# Altium project ClubNIKA.PrjPcb
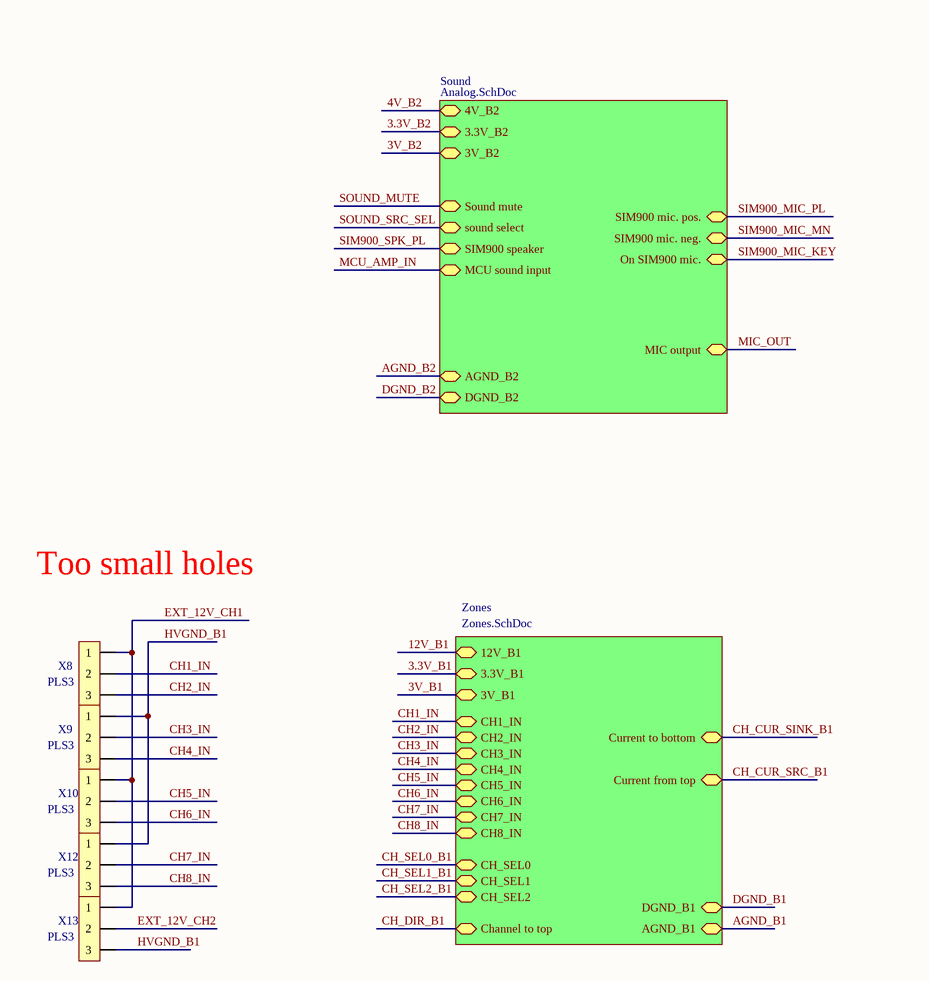
[diagram p0: ClubNIKA.SchDoc, top left]
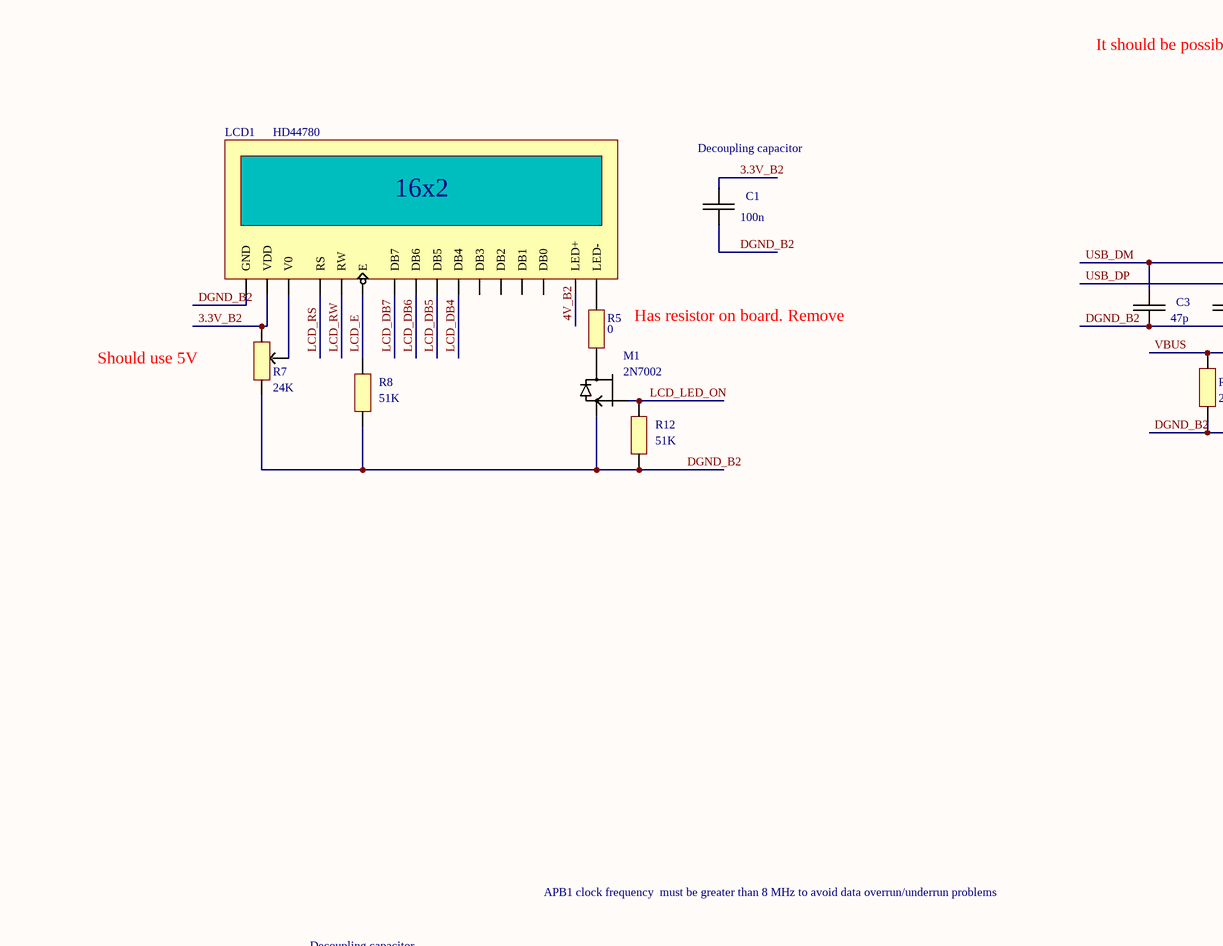
[diagram p1: ClubNIKA.SchDoc, top middle]
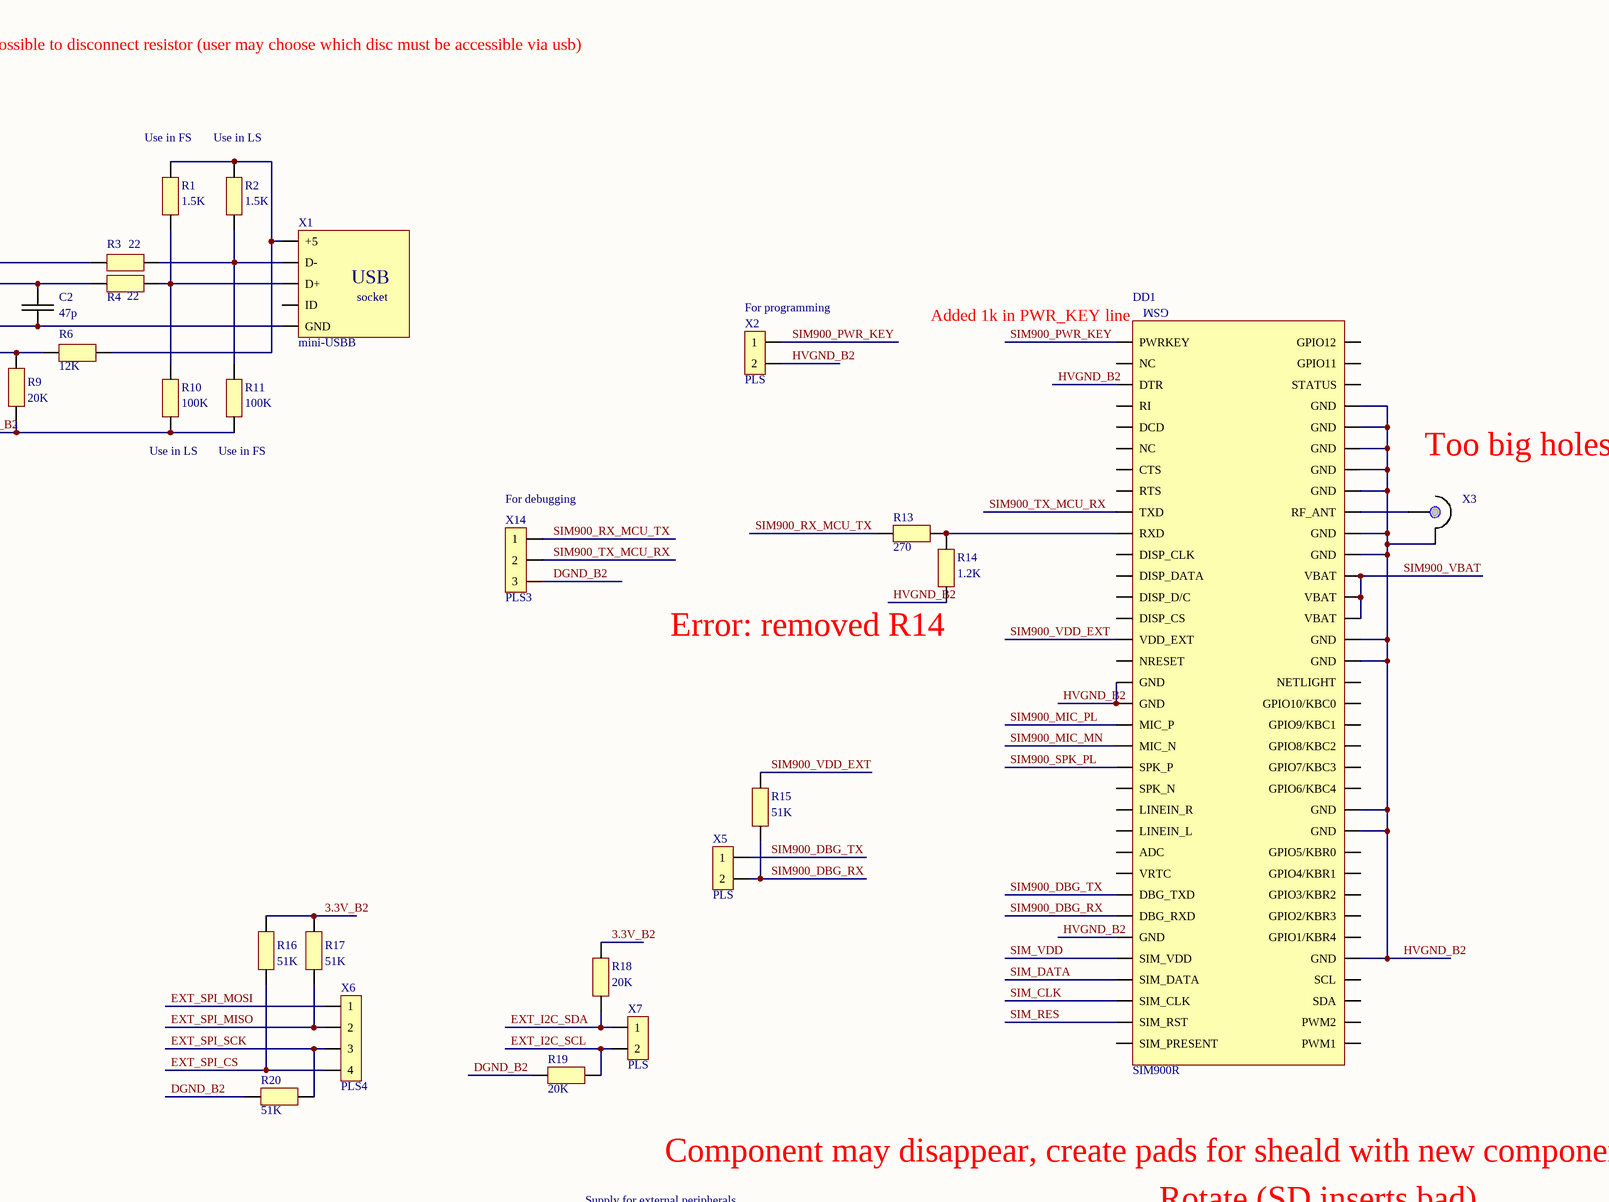
[diagram p2: ClubNIKA.SchDoc, top right]
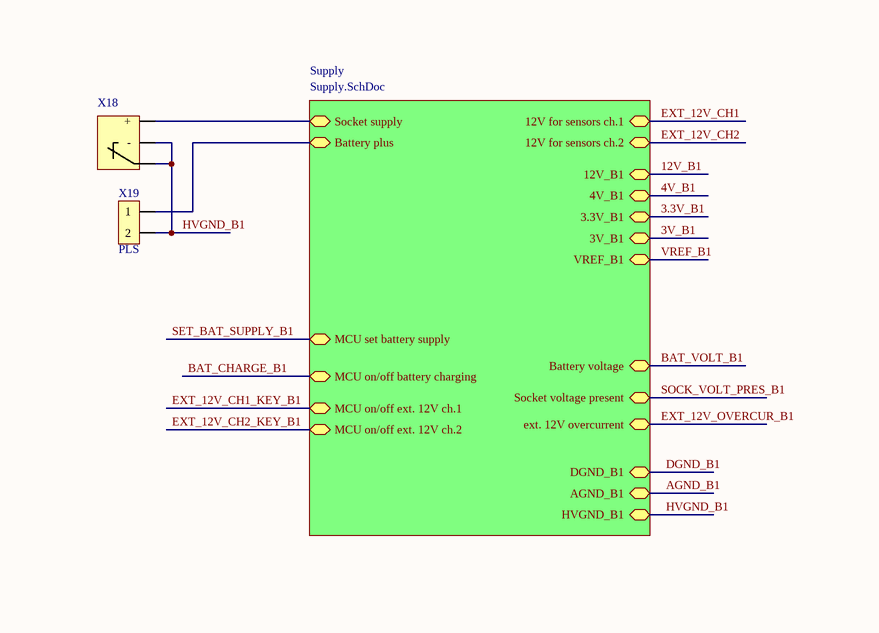
[diagram p3: ClubNIKA.SchDoc, bottom left]
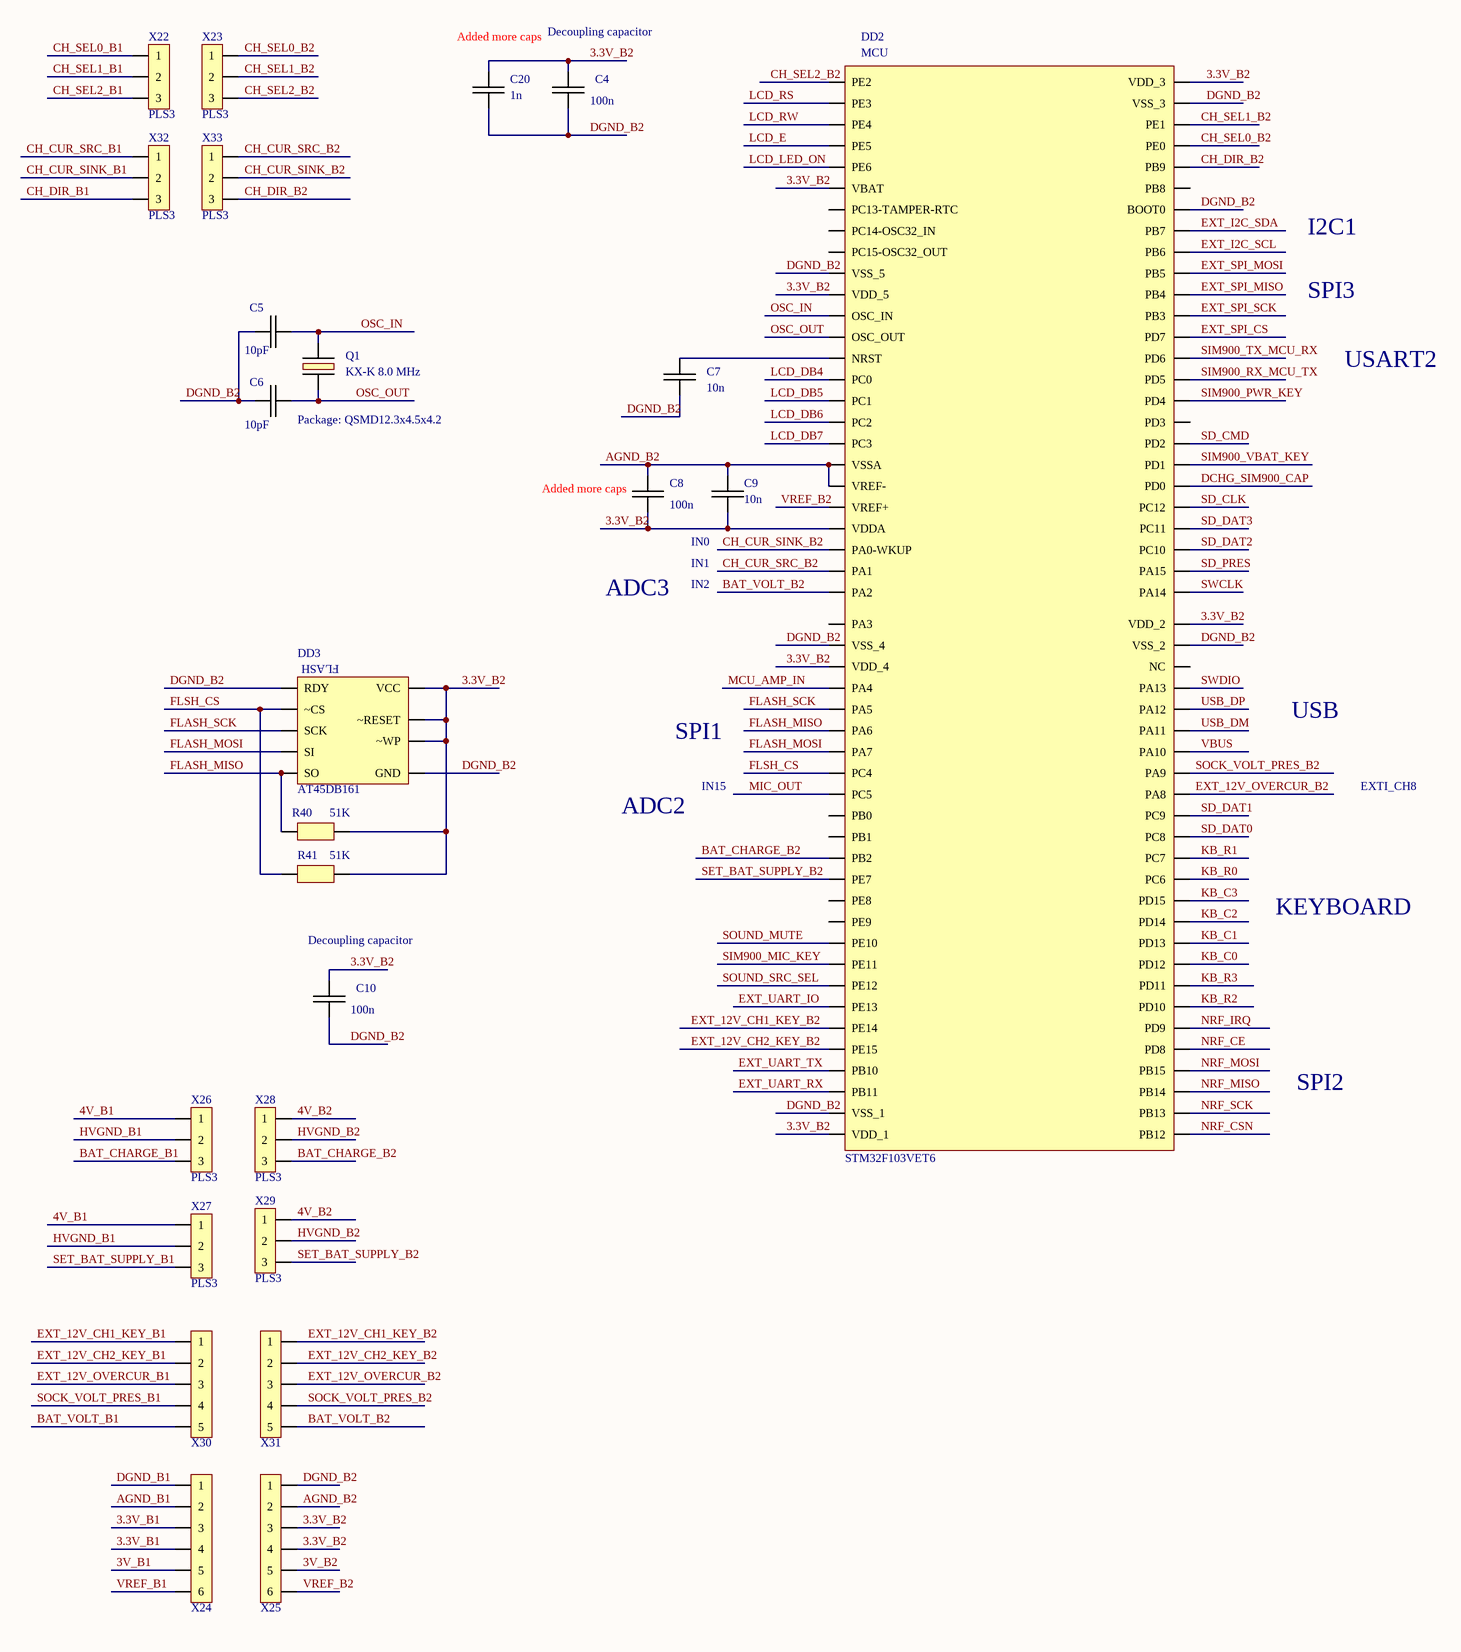
[diagram p4: ClubNIKA.SchDoc, bottom middle]
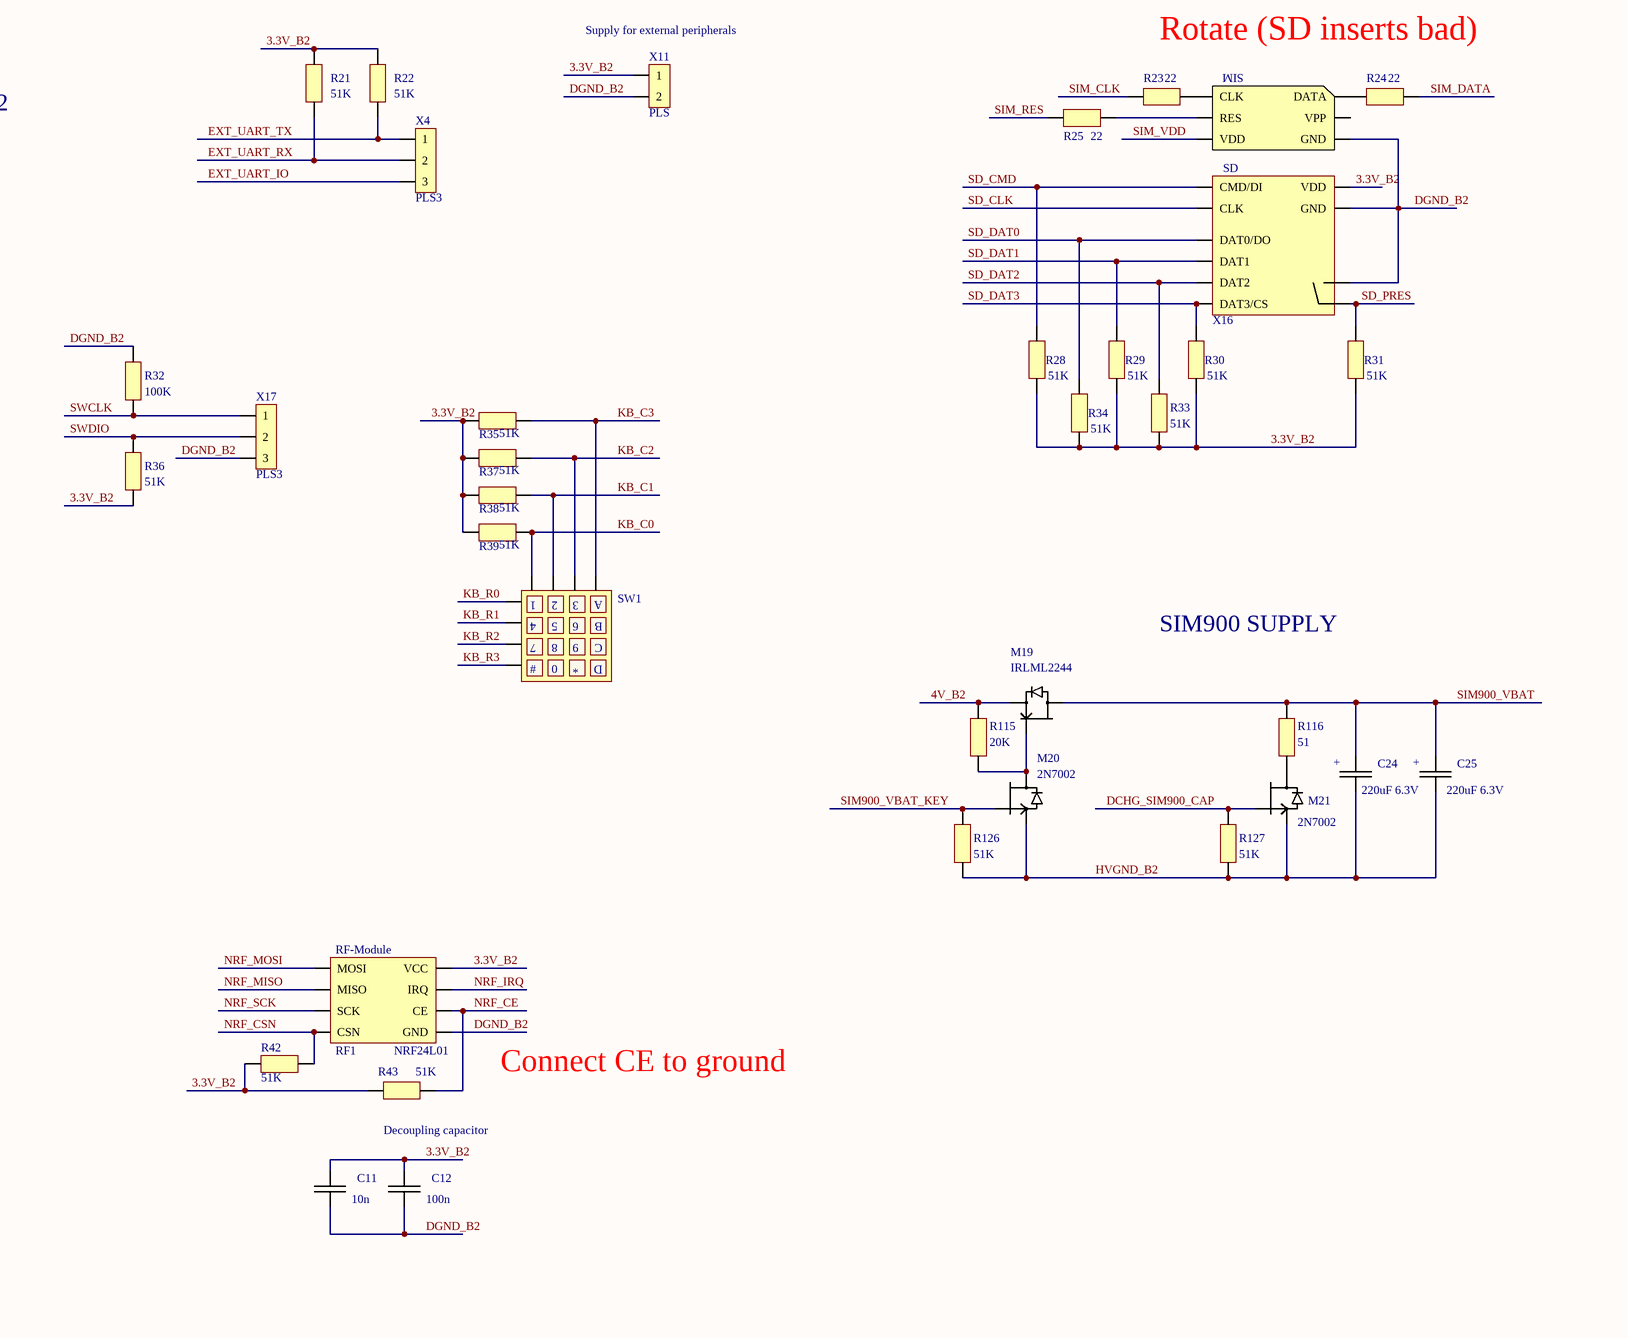
[diagram p5: ClubNIKA.SchDoc, bottom right]
4 sheets, 346 parts. Net scope: hierarchical (ports join the sheet entries above them; power ports are global).
Board file: ClubNIKA.PcbDoc
Sheets:
  ClubNIKA.SchDoc
    Zones = Zones.SchDoc
    Supply = Supply.SchDoc
    Sound = Analog.SchDoc

## Sheet ClubNIKA.SchDoc
size A1

### Parts
C1  100n  [0805]
C2  47p  [0805]
C3  47p  [0805]
C4  100n  [0805]
C5  10pF  [0805]
C6  10pF  [0805]
C7  10n  [0805]
C8  100n  [0805]
C9  10n  [0805]
C10  100n  [0805]
C11  10n  [0805]
C12  100n  [0805]
C20  1n  [0805]
C24  220uF 6.3V  [CALUM_THT_E5D13]
C25  220uF 6.3V  [CALUM_THT_E5D13]
DD1  SIM900R  [SIM900_R]
DD2  STM32F103VET6  [QFP100]
DD3  AT45DB161  [TSOP28]
LCD1  HD44780  [LCD_HD44780_5]
M1  2N7002  [SOT-23]
M19  IRLML2244  [SOT-23]
M20  2N7002  [SOT-23]
M21  2N7002  [SOT-23]
Q1  KX-K 8.0 MHz  [OSC1_THT_10,8x4,5]
R1  1.5K  [0805]
R2  1.5K  [0805]
R3  22  [0805]
R4  22  [0805]
R5  0  [1206]
R6  12K  [0805]
R7  24K  [3305SMD(adj res)]
R8  51K  [0805]
R9  20K  [0805]
R10  100K  [0805]
R11  100K  [0805]
R12  51K  [0805]
R13  270  [0805]
R14  1.2K  [0805]
R15  51K  [0805]
R16  51K  [0805]
R17  51K  [0805]
R18  20K  [0805]
R19  20K  [0805]
R20  51K  [0805]
R21  51K  [0805]
R22  51K  [0805]
R23  22  [0805]
R24  22  [0805]
R25  22  [0805]
R28  51K  [0805]
R29  51K  [0805]
R30  51K  [0805]
R31  51K  [0805]
R32  100K  [0805]
R33  51K  [0805]
R34  51K  [0805]
R35  51K  [0805]
R36  51K  [0805]
R37  51K  [0805]
R38  51K  [0805]
R39  51K  [0805]
R40  51K  [0805]
R41  51K  [0805]
R42  51K  [0805]
R43  51K  [0805]
R115  20K  [0805]
R116  51  [0805]
R126  51K  [0805]
R127  51K  [0805]
RF1  NRF24L01  [NRF24L01_MOD_ANGLE]
SW1  KEYBOARD4x4  [KEYBOURD_4x4_1]  (value not drawn)
X1  mini-USBB  [MINI_USBA_FEMALE]
X2  PLS  [PLS_2]
X3  SMA_FEMALE  [SMA_FEMALE]  (value not drawn)
X4  PLS3  [PLS_3]
X5  PLS  [PLS_2]
X6  PLS4  [PLS_4]
X7  PLS  [PLS_2]
X8  PLS3  [TERMINALS_7.7x15.5(step 5mm)]
X9  PLS3  [TERMINALS_7.7x15.5(step 5mm)]
X10  PLS3  [TERMINALS_7.7x15.5(step 5mm)]
X11  PLS  [PLS_2]
X12  PLS3  [TERMINALS_7.7x15.5(step 5mm)]
X13  PLS3  [TERMINALS_7.7x15.5(step 5mm)]
X14  PLS3  [PLS_3]
X16  SIM_SD_HOLDER1  [SIM_SD_HOLDER1]  (value not drawn)
X17  PLS3  [PLS_3]
X18  SUPPLY_1  [SUP_SOCK_D5.5D1.8]  (value not drawn)
X19  PLS  [PLS_2]
X22  PLS3  [PLS_3]
X23  PLS3  [PLS_3]
X24  PLS6  [PLS_6]  (value not drawn)
X25  PLS6  [PLS_6]  (value not drawn)
X26  PLS3  [PLS_3]
X27  PLS3  [PLS_3]
X28  PLS3  [PLS_3]
X29  PLS3  [PLS_3]
X30  CONT_5  [PLS_5]  (value not drawn)
X31  CONT_5  [PLS_5]  (value not drawn)
X32  PLS3  [PLS_3]
X33  PLS3  [PLS_3]

### Sub-sheets
Sound = Analog.SchDoc: Sound mute, AGND_B2, 4V_B2, 3.3V_B2, MCU sound input, SIM900 mic. pos., SIM900 mic. neg., MIC output, 3V_B2, SIM900 speaker, sound select, On SIM900 mic., DGND_B2
Supply = Supply.SchDoc: 12V for sensors ch.1, MCU on/off battery charging, Socket supply, Battery plus, Battery voltage, Socket voltage present, MCU set battery supply, ext. 12V overcurrent, 12V for sensors ch.2, MCU on/off ext. 12V ch.1, MCU on/off ext. 12V ch.2, HVGND_B1, 3.3V_B1, AGND_B1, DGND_B1, 4V_B1, VREF_B1, 12V_B1, 3V_B1
Zones = Zones.SchDoc: CH1_IN, CH2_IN, CH3_IN, CH4_IN, CH5_IN, CH6_IN, CH_SEL0, CH_SEL1, CH_SEL2, Channel to top, Current to bottom, Current from top, CH7_IN, CH8_IN, DGND_B1, AGND_B1, 3.3V_B1, 12V_B1, 3V_B1

### Nets
3.3V_B1: X24.3 X24.4 ; sheet Zones/3.3V_B1, sheet Supply/3.3V_B1
3.3V_B2: C1.2 C4.2 C8.1 C9.1 C10.2 C11.2 C12.2 C20.2 DD2.6(VBAT) DD2.11(VDD_5) DD2.22(VDDA) DD2.28(VDD_4) DD2.50(VDD_1) DD2.75(VDD_2) DD2.100(VDD_3) DD3.2(~RESET) DD3.3(~WP) DD3.6(VCC) LCD1.VDD R7.1 R16.1 R17.1 R18.1 R21.1 R22.1 R28.2 R29.2 R30.2 R31.2 R33.2 R34.2 R35.2 R36.2 R37.2 R38.2 R39.2 R40.2 R41.2 R42.1 R43.2 RF1.2(VCC) X11.1 X16.SD_VDD(VDD) X25.3 X25.4 ; sheet Sound/3.3V_B2
3V_B1: X24.5 ; sheet Zones/3V_B1, sheet Supply/3V_B1
3V_B2: X25.5 ; sheet Sound/3V_B2
4V_B1: X26.1 X27.1 ; sheet Supply/4V_B1
4V_B2: LCD1.LED+ M19.2 R115.1 X28.1 X29.1 ; sheet Sound/4V_B2
12V_B1: sheet Zones/12V_B1, sheet Supply/12V_B1
AGND_B1: X24.2 ; sheet Zones/AGND_B1, sheet Supply/AGND_B1
AGND_B2: C8.2 C9.2 DD2.19(VSSA) DD2.20(VREF-) X25.2 ; sheet Sound/AGND_B2
BAT_CHARGE_B1: X26.3 ; sheet Supply/MCU on/off battery charging
BAT_CHARGE_B2: DD2.37(PB2) X28.3
BAT_VOLT_B1: X30.5 ; sheet Supply/Battery voltage
BAT_VOLT_B2: DD2.25(PA2) X31.5
BATTERY: X19.1 ; sheet Supply/Battery plus
CH1_IN: X8.2 ; sheet Zones/CH1_IN
CH2_IN: X8.3 ; sheet Zones/CH2_IN
CH3_IN: X9.2 ; sheet Zones/CH3_IN
CH4_IN: X9.3 ; sheet Zones/CH4_IN
CH5_IN: X10.2 ; sheet Zones/CH5_IN
CH6_IN: X10.3 ; sheet Zones/CH6_IN
CH7_IN: X12.2 ; sheet Zones/CH7_IN
CH8_IN: X12.3 ; sheet Zones/CH8_IN
CH_CUR_SINK_B1: X32.2 ; sheet Zones/Current to bottom
CH_CUR_SINK_B2: DD2.23(PA0-WKUP) X33.2
CH_CUR_SRC_B1: X32.1 ; sheet Zones/Current from top
CH_CUR_SRC_B2: DD2.24(PA1) X33.1
CH_DIR_B1: X32.3 ; sheet Zones/Channel to top
CH_DIR_B2: DD2.96(PB9) X33.3
CH_SEL0_B1: X22.1 ; sheet Zones/CH_SEL0
CH_SEL0_B2: DD2.97(PE0) X23.1
CH_SEL1_B1: X22.2 ; sheet Zones/CH_SEL1
CH_SEL1_B2: DD2.98(PE1) X23.2
CH_SEL2_B1: X22.3 ; sheet Zones/CH_SEL2
CH_SEL2_B2: DD2.1(PE2) X23.3
DCHG_SIM900_CAP: DD2.81(PD0) M21.1 R127.1
DGND_B1: X24.1 ; sheet Zones/DGND_B1, sheet Supply/DGND_B1
DGND_B2: C1.1 C2.1 C3.1 C4.1 C5.1 C6.1 C7.1 C10.1 C11.1 C12.1 C20.1 DD2.10(VSS_5) DD2.27(VSS_4) DD2.49(VSS_1) DD2.74(VSS_2) DD2.94(BOOT0) DD2.99(VSS_3) DD3.1(RDY) DD3.7(GND) LCD1.GND M1.2 R7.2 R8.2 R9.2 R10.2 R11.2 R12.2 R19.1 R20.1 R32.1 RF1.1(GND) X1.GND X11.2 X14.3 X16.SD_GND(GND) X16.SD_PRES1 X16.SIM_GND(GND) X17.3 X25.1 ; sheet Sound/DGND_B2
EXT_12V_CH1: X8.1 X10.1 X13.1 ; sheet Supply/12V for sensors ch.1
EXT_12V_CH1_KEY_B1: X30.1 ; sheet Supply/MCU on/off ext. 12V ch.1
EXT_12V_CH1_KEY_B2: DD2.45(PE14) X31.1
EXT_12V_CH2: X13.2 ; sheet Supply/12V for sensors ch.2
EXT_12V_CH2_KEY_B1: X30.2 ; sheet Supply/MCU on/off ext. 12V ch.2
EXT_12V_CH2_KEY_B2: DD2.46(PE15) X31.2
EXT_12V_OVERCUR_B1: X30.3 ; sheet Supply/ext. 12V overcurrent
EXT_12V_OVERCUR_B2: DD2.67(PA8) X31.3
EXT_I2C_SCL: DD2.92(PB6) R19.2 X7.2
EXT_I2C_SDA: DD2.93(PB7) R18.2 X7.1
EXT_SPI_CS: DD2.88(PD7) R16.2 X6.4
EXT_SPI_MISO: DD2.90(PB4) R17.2 X6.2
EXT_SPI_MOSI: DD2.91(PB5) X6.1
EXT_SPI_SCK: DD2.89(PB3) R20.2 X6.3
EXT_UART_IO: DD2.44(PE13) X4.3
EXT_UART_RX: DD2.48(PB11) R21.2 X4.2
EXT_UART_TX: DD2.47(PB10) R22.2 X4.1
FLASH_MISO: DD2.31(PA6) DD3.14(SO) R40.1
FLASH_MOSI: DD2.32(PA7) DD3.13(SI)
FLASH_SCK: DD2.30(PA5) DD3.12(SCK)
FLSH_CS: DD2.33(PC4) DD3.11(~CS) R41.1
HVGND_B1: X9.1 X12.1 X13.3 X18.- X18.PRES X19.2 X26.2 X27.2 ; sheet Supply/HVGND_B1
HVGND_B2: C24.2 C25.2 DD1.3(DTR) DD1.17(GND) DD1.18(GND) DD1.29(GND) DD1.39(GND) DD1.45(GND) DD1.46(GND) DD1.53(GND) DD1.54(GND) DD1.58(GND) DD1.59(GND) DD1.61(GND) DD1.62(GND) DD1.63(GND) DD1.64(GND) DD1.65(GND) M20.2 M21.2 R14.2 R126.2 R127.2 X2.2 X3.2 X28.2 X29.2
KB_C0: DD2.59(PD12) R39.1 SW1.C1
KB_C1: DD2.60(PD13) R38.1 SW1.C2
KB_C2: DD2.61(PD14) R37.1 SW1.C3
KB_C3: DD2.62(PD15) R35.1 SW1.C4
KB_R0: DD2.63(PC6) SW1.R1
KB_R1: DD2.64(PC7) SW1.R2
KB_R2: DD2.57(PD10) SW1.R3
KB_R3: DD2.58(PD11) SW1.R4
LCD_DB4: DD2.15(PC0) LCD1.DB4
LCD_DB5: DD2.16(PC1) LCD1.DB5
LCD_DB6: DD2.17(PC2) LCD1.DB6
LCD_DB7: DD2.18(PC3) LCD1.DB7
LCD_E: DD2.4(PE5) LCD1.E R8.1
LCD_LED_ON: DD2.5(PE6) M1.1 R12.1
LCD_RS: DD2.2(PE3) LCD1.RS
LCD_RW: DD2.3(PE4) LCD1.RW
MCU_AMP_IN: DD2.29(PA4) ; sheet Sound/MCU sound input
MIC_OUT: DD2.34(PC5) ; sheet Sound/MIC output
NRF_CE: DD2.55(PD8) R43.1 RF1.3(CE)
NRF_CSN: DD2.51(PB12) R42.2 RF1.4(CSN)
NRF_IRQ: DD2.56(PD9) RF1.8(IRQ)
NRF_MISO: DD2.53(PB14) RF1.7(MISO)
NRF_MOSI: DD2.54(PB15) RF1.6(MOSI)
NRF_SCK: DD2.52(PB13) RF1.5(SCK)
OSC_IN: C5.2 DD2.12(OSC_IN) Q1.1
OSC_OUT: C6.2 DD2.13(OSC_OUT) Q1.2
SD_CLK: DD2.80(PC12) X16.SD_CLK(CLK)
SD_CMD: DD2.83(PD2) R28.1 X16.SD_CMD(CMD/DI)
SD_DAT0: DD2.65(PC8) R34.1 X16.SD_DAT0(DAT0/DO)
SD_DAT1: DD2.66(PC9) R29.1 X16.SD_DAT1(DAT1)
SD_DAT2: DD2.78(PC10) R33.1 X16.SD_DAT2(DAT2)
SD_DAT3: DD2.79(PC11) R30.1 X16.SD_DAT3(DAT3/CS)
SD_PRES: DD2.77(PA15) R31.1 X16.SD_PRES2
SET_BAT_SUPPLY_B1: X27.3 ; sheet Supply/MCU set battery supply
SET_BAT_SUPPLY_B2: DD2.38(PE7) X29.3
SIM900_DBG_RX: DD1.28(DBG_RXD) R15.2 X5.2
SIM900_DBG_TX: DD1.27(DBG_TXD) X5.1
SIM900_MIC_KEY: DD2.42(PE11) ; sheet Sound/On SIM900 mic.
SIM900_MIC_MN: DD1.20(MIC_N) ; sheet Sound/SIM900 mic. neg.
SIM900_MIC_PL: DD1.19(MIC_P) ; sheet Sound/SIM900 mic. pos.
SIM900_PWR_KEY: DD1.1(PWRKEY) DD2.85(PD4) X2.1
SIM900_RX_MCU_TX: DD2.86(PD5) R13.1 X14.1
SIM900_SPK_PL: DD1.21(SPK_P) ; sheet Sound/SIM900 speaker
SIM900_TX_MCU_RX: DD1.9(TXD) DD2.87(PD6) X14.2
SIM900_VBAT: C24.1 C25.1 DD1.55(VBAT) DD1.56(VBAT) DD1.57(VBAT) M19.3 R116.1
SIM900_VBAT_KEY: DD2.82(PD1) M20.1 R126.1
SIM900_VDD_EXT: DD1.15(VDD_EXT) R15.1
SIM_CLK: DD1.32(SIM_CLK) R23.2
SIM_DATA: DD1.31(SIM_DATA) R24.1
SIM_RES: DD1.33(SIM_RST) R25.2
SIM_VDD: DD1.30(SIM_VDD) X16.SIM_VDD(VDD)
SOCK_VOLT_PRES_B1: X30.4 ; sheet Supply/Socket voltage present
SOCK_VOLT_PRES_B2: DD2.68(PA9) X31.4
SOCKET: X18.+ ; sheet Supply/Socket supply
SOUND_MUTE: DD2.41(PE10) ; sheet Sound/Sound mute
SOUND_SRC_SEL: DD2.43(PE12) ; sheet Sound/sound select
SWCLK: DD2.76(PA14) R32.2 X17.1
SWDIO: DD2.72(PA13) R36.1 X17.2
USB_DM: C3.2 DD2.70(PA11) R3.2
USB_DP: C2.2 DD2.71(PA12) R4.2
VBUS: DD2.69(PA10) R6.2 R9.1
VREF_B1: X24.6 ; sheet Supply/VREF_B1
VREF_B2: DD2.21(VREF+) X25.6
NetC7_2: C7.2 DD2.14(NRST)
NetDD1_10: DD1.10(RXD) R13.2 R14.1
NetDD1_60: DD1.60(RF_ANT) X3.1
NetLCD1_LED-: LCD1.LED- R5.1
NetLCD1_V0: LCD1.V0 R7.3
NetM1_3: M1.3 R5.2
NetM19_1: M19.1 M20.3 R115.2
NetM21_3: M21.3 R116.2
NetR1_1: R1.1 R2.1 R6.1 X1.+5
NetR1_2: R1.2 R4.1 R10.1 X1.D+
NetR2_2: R2.2 R3.1 R11.1 X1.D-
NetR23_1: R23.1 X16.SIM_CLK(CLK)
NetR24_2: R24.2 X16.SIM_DATA(DATA)
NetR25_1: R25.1 X16.SIM_RES(RES)

Not connected (* = marked no-connect by the designer): DD1 2(NC) 4(RI) 5(DCD) 6(NC) 7(CTS) 8(RTS) 11(DISP_CLK) 12(DISP_DATA) 13(DISP_D/C) 14(DISP_CS) 16(NRESET) 22(SPK_N) 23(LINEIN_R) 24(LINEIN_L) 25(ADC) 26(VRTC) 34(SIM_PRESENT) 35(PWM1) 36(PWM2) 37(SDA) 38(SCL) 40(GPIO1/KBR4) 41(GPIO2/KBR3) 42(GPIO3/KBR2) 43(GPIO4/KBR1) 44(GPIO5/KBR0) 47(GPIO6/KBC4) 48(GPIO7/KBC3) 49(GPIO8/KBC2) 50(GPIO9/KBC1) 51(GPIO10/KBC0) 52(NETLIGHT) 66(STATUS) 67(GPIO11) 68(GPIO12); DD2 7(PC13-TAMPER-RTC) 8(PC14-OSC32_IN) 9(PC15-OSC32_OUT) 26(PA3) 35(PB0) 36(PB1) 39(PE8) 40(PE9) 73(NC) 84(PD3) 95(PB8); LCD1 DB0 DB1 DB2 DB3; X1 ID; X16 SIM_VPP(VPP)

### Notes on the sheet
- It should be possible to disconnect resistor (user may choose which disc must be accessible via usb)
- (near C1) Decoupling capacitor
- Use in FS
- (near R2) Use in LS
- Should use 5V
- Has resistor on board. Remove
- (near X2) For programming
- (near DD1) Added 1k in PWR_KEY line
- Use in LS
- (near R11) Use in FS
- (near X3) Too big holes
- (near X14) For debugging
- (near R14) Error: removed R14
- APB1 clock frequency  must be greater than 8 MHz to avoid data overrun/underrun problems
- Too small holes
- Added more caps
- Decoupling capacitor
- I2C1
- Component may disappear, create pads for sheald with new component
- SPI3
- (near X11) Supply for external peripherals
- Rotate (SD inserts bad)
- USART2
- Package: QSMD12.3x4.5x4.2
- (near C8) Added more caps
- IN1
- IN2
- IN0
- ADC3
- USB
- SPI1
- IN15
- EXTI_CH8
- ADC2
- KEYBOARD
- SIM900 SUPPLY
- SPI2
- Connect CE to ground
- (in symbol AT45DB161/321) FLASH
- (in symbol C_POL) +
- (in symbol KEYBOARD4x4) 1; 2; 3; A; 4; 5; 6; B; 7; 8; 9; C; #; 0; D
- (in symbol LCD 16x2 HD44780) 16x2
- (in symbol MINI_USB_FEMALE) USB; socket
- (in symbol NRF24L01) RF-Module
- (in symbol SIM900R) GSM
- (in symbol SIM_SD_HOLDER1) SIM; SD
- (in symbol STM32F103Vx) MCU

### Library data of the parts
C1-C12 C20 = C
C24 C25 = C_POL
DD2 = STM32F103Vx
DD3 = AT45DB161/321
LCD1 = LCD 16x2 HD44780
M1 M20 M21 = NMOS+DIODE
M19 = PMOS+DIODE
Q1 = XTAL
R1-R6 R8-R25 R28-R43 R115 R116 R126 R127 = R
R7 = Radj
X1 = MINI_USB_FEMALE
X2 X5 X7 X11 X19 = CONT_2
X4 X8-X10 X12-X14 X17 X22 X23 X26-X29 X32 X33 = CONT_3
X6 = CONT_4
X24 X25 = CONT_6

## Sheet Zones.SchDoc
size A2
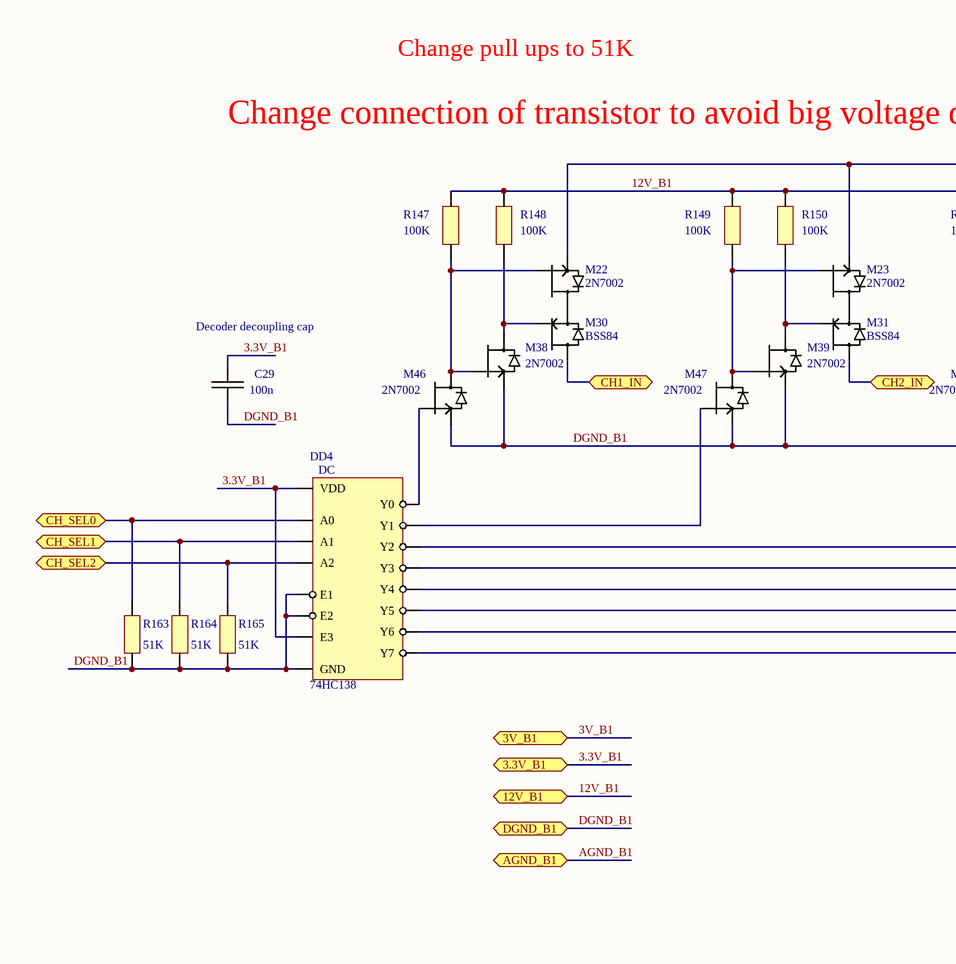
[diagram p6: Zones.SchDoc, left]
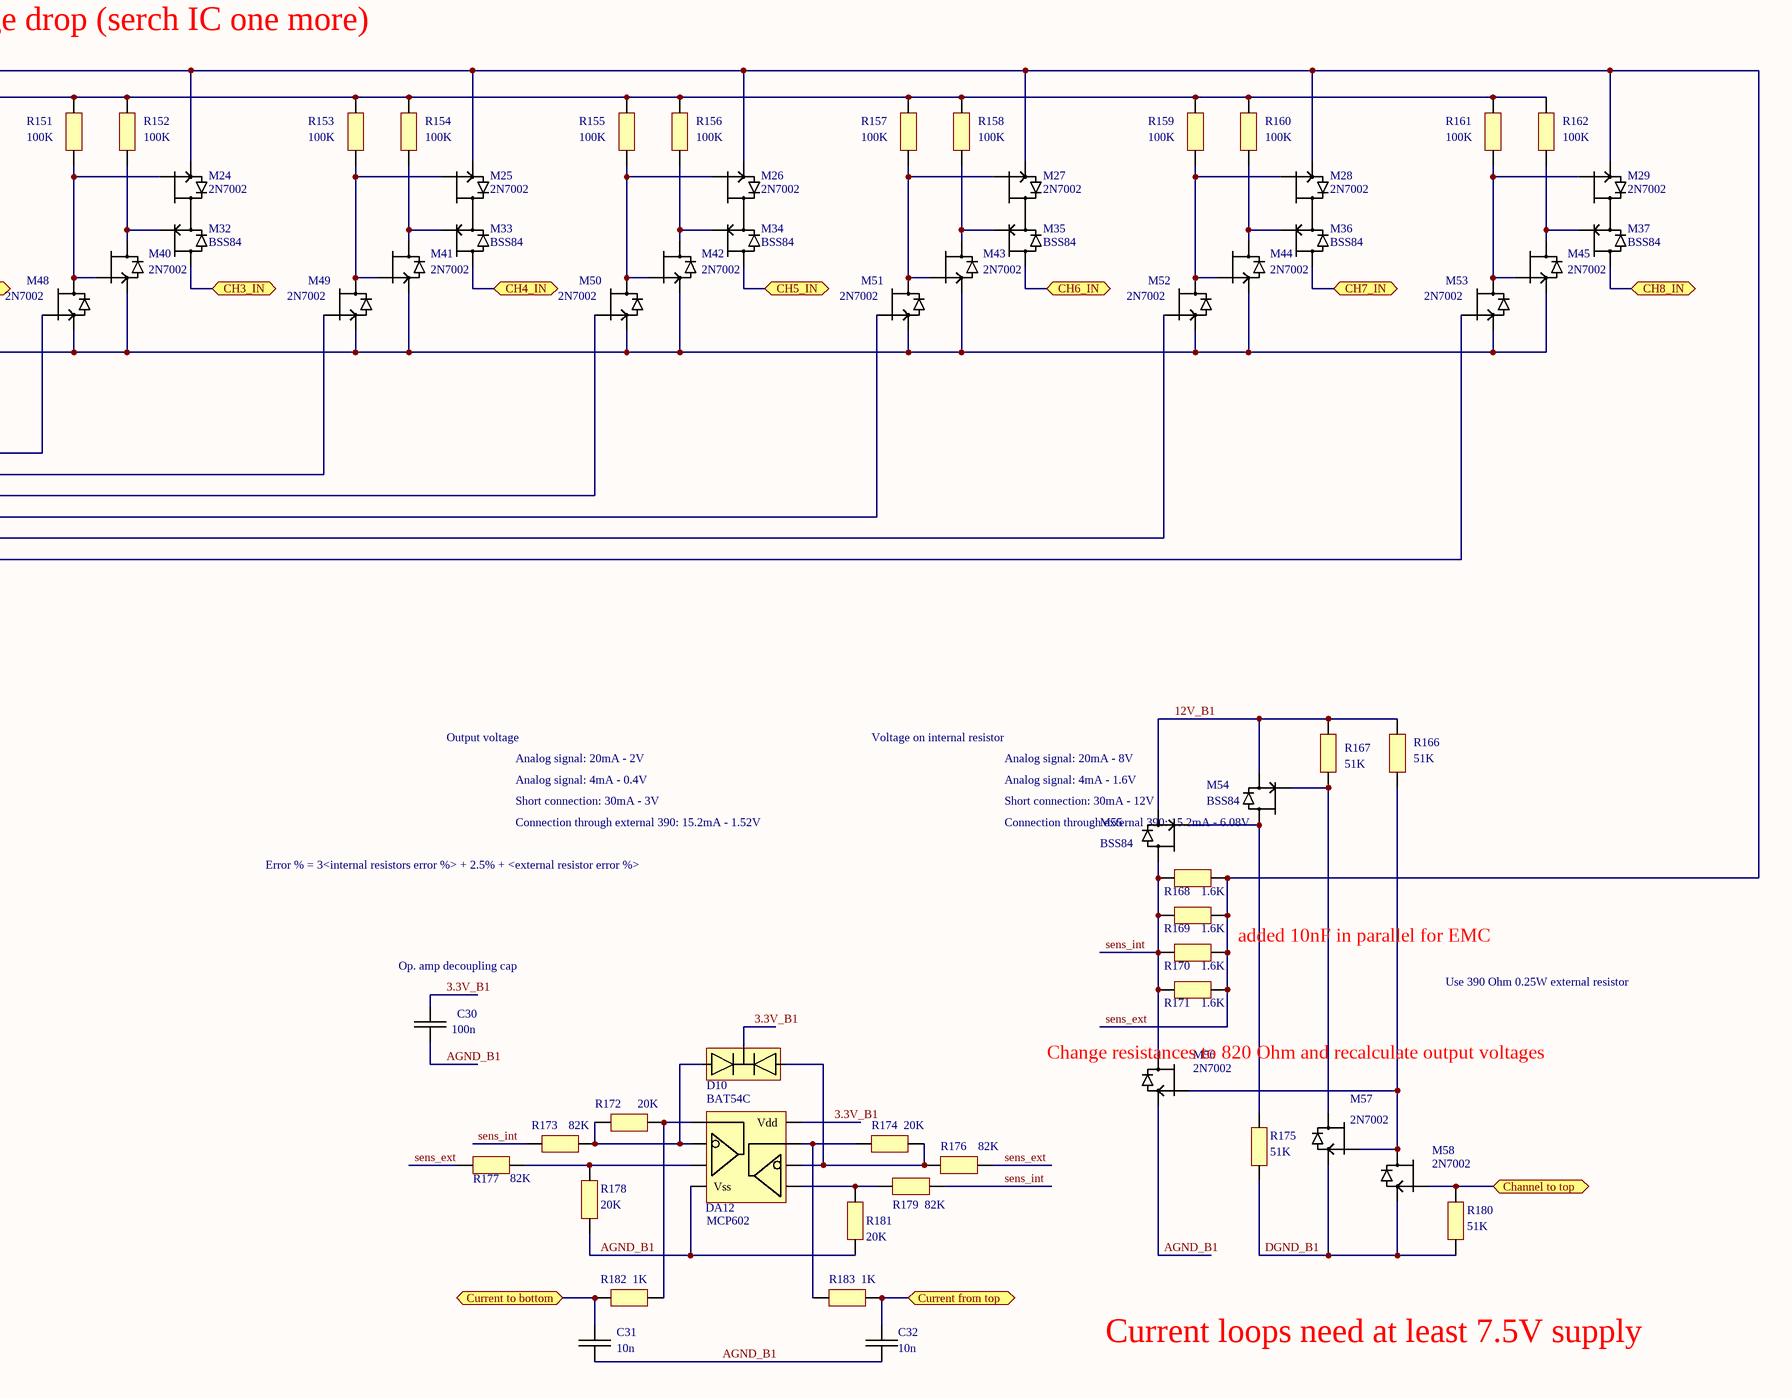
[diagram p7: Zones.SchDoc, right]

### Parts
C29  100n  [0805]
C30  100n  [0805]
C31  10n  [0805]
C32  10n  [0805]
D10  BAT54C  [SOT-23]
DA12  MCP602  [SOP8]
DD4  74HC138  [SOP16]
M22  2N7002  [SOT-23]
M23  2N7002  [SOT-23]
M24  2N7002  [SOT-23]
M25  2N7002  [SOT-23]
M26  2N7002  [SOT-23]
M27  2N7002  [SOT-23]
M28  2N7002  [SOT-23]
M29  2N7002  [SOT-23]
M30  BSS84  [SOT-23]
M31  BSS84  [SOT-23]
M32  BSS84  [SOT-23]
M33  BSS84  [SOT-23]
M34  BSS84  [SOT-23]
M35  BSS84  [SOT-23]
M36  BSS84  [SOT-23]
M37  BSS84  [SOT-23]
M38  2N7002  [SOT-23]
M39  2N7002  [SOT-23]
M40  2N7002  [SOT-23]
M41  2N7002  [SOT-23]
M42  2N7002  [SOT-23]
M43  2N7002  [SOT-23]
M44  2N7002  [SOT-23]
M45  2N7002  [SOT-23]
M46  2N7002  [SOT-23]
M47  2N7002  [SOT-23]
M48  2N7002  [SOT-23]
M49  2N7002  [SOT-23]
M50  2N7002  [SOT-23]
M51  2N7002  [SOT-23]
M52  2N7002  [SOT-23]
M53  2N7002  [SOT-23]
M54  BSS84  [SOT-23]
M55  BSS84  [SOT-23]
M56  2N7002  [SOT-23]
M57  2N7002  [SOT-23]
M58  2N7002  [SOT-23]
R147  100K  [0805]
R148  100K  [0805]
R149  100K  [0805]
R150  100K  [0805]
R151  100K  [0805]
R152  100K  [0805]
R153  100K  [0805]
R154  100K  [0805]
R155  100K  [0805]
R156  100K  [0805]
R157  100K  [0805]
R158  100K  [0805]
R159  100K  [0805]
R160  100K  [0805]
R161  100K  [0805]
R162  100K  [0805]
R163  51K  [0805]
R164  51K  [0805]
R165  51K  [0805]
R166  51K  [0805]
R167  51K  [0805]
R168  1.6K  [1206]
R169  1.6K  [1206]
R170  1.6K  [1206]
R171  1.6K  [1206]
R172  20K  [0805]
R173  82K  [0805]
R174  20K  [0805]
R175  51K  [0805]
R176  82K  [0805]
R177  82K  [0805]
R178  20K  [0805]
R179  82K  [0805]
R180  51K  [0805]
R181  20K  [0805]
R182  1K  [0805]
R183  1K  [0805]

### Ports
3.3V_B1, 3V_B1, 12V_B1, AGND_B1, CH1_IN, CH2_IN, CH3_IN, CH4_IN, CH5_IN, CH6_IN, CH7_IN, CH8_IN, CH_SEL0, CH_SEL1, CH_SEL2, Channel to top, Current from top, Current to bottom, DGND_B1

### Nets
3.3V_B1: C29.2 C30.2 D10.3(AK) DA12.8(Vdd) DD4.6(E3) DD4.16(VDD) ; port 3.3V_B1
12V_B1: M54.2 M55.2 R147.1 R148.1 R149.1 R150.1 R151.1 R152.1 R153.1 R154.1 R155.1 R156.1 R157.1 R158.1 R159.1 R160.1 R161.1 R162.1 R166.1 R167.1 ; port 12V_B1
AGND_B1: C30.1 C31.1 C32.1 DA12.4(Vss) M56.2 R178.2 R181.2 ; port AGND_B1
CH1_IN: M30.3 ; port CH1_IN
CH2_IN: M31.3 ; port CH2_IN
CH3_IN: M32.3 ; port CH3_IN
CH4_IN: M33.3 ; port CH4_IN
CH5_IN: M34.3 ; port CH5_IN
CH6_IN: M35.3 ; port CH6_IN
CH7_IN: M36.3 ; port CH7_IN
CH8_IN: M37.3 ; port CH8_IN
CH_CUR_SINK_B1: C31.2 R182.2 ; port Current to bottom
CH_CUR_SRC_B1: C32.2 R183.1 ; port Current from top
CH_DIR_B1: M58.1 R180.1 ; port Channel to top
CH_SEL0_B1: DD4.1(A0) R163.1 ; port CH_SEL0
CH_SEL1_B1: DD4.2(A1) R164.1 ; port CH_SEL1
CH_SEL2_B1: DD4.3(A2) R165.1 ; port CH_SEL2
DGND_B1: C29.1 DD4.4(E1) DD4.5(E2) DD4.8(GND) M38.2 M39.2 M40.2 M41.2 M42.2 M43.2 M44.2 M45.2 M46.2 M47.2 M48.2 M49.2 M50.2 M51.2 M52.2 M53.2 M57.2 M58.2 R163.2 R164.2 R165.2 R175.2 R180.2 ; port DGND_B1
sens_ext: M22.2 M23.2 M24.2 M25.2 M26.2 M27.2 M28.2 M29.2 R168.1 R169.1 R170.1 R171.1 R176.1 R177.1
sens_int: M55.3 M56.3 R168.2 R169.2 R170.2 R171.2 R173.1 R179.1
NetD10_1: D10.1(A1) DA12.6 R174.1 R176.2
NetD10_2: D10.2(K2) DA12.2 R172.1 R173.2
NetDA12_1: DA12.1 R172.2 R182.1
NetDA12_3: DA12.3 R177.2 R178.1
NetDA12_5: DA12.5 R179.2 R181.1
NetDA12_7: DA12.7 R174.2 R183.2
NetDD4_7: DD4.7(Y7) M53.1
NetDD4_9: DD4.9(Y6) M52.1
NetDD4_10: DD4.10(Y5) M51.1
NetDD4_11: DD4.11(Y4) M50.1
NetDD4_12: DD4.12(Y3) M49.1
NetDD4_13: DD4.13(Y2) M48.1
NetDD4_14: DD4.14(Y1) M47.1
NetDD4_15: DD4.15(Y0) M46.1
NetM22_1: M22.1 M38.1 M46.3 R147.2
NetM22_3: M22.3 M30.2
NetM23_1: M23.1 M39.1 M47.3 R149.2
NetM23_3: M23.3 M31.2
NetM24_1: M24.1 M40.1 M48.3 R151.2
NetM24_3: M24.3 M32.2
NetM25_1: M25.1 M41.1 M49.3 R153.2
NetM25_3: M25.3 M33.2
NetM26_1: M26.1 M42.1 M50.3 R155.2
NetM26_3: M26.3 M34.2
NetM27_1: M27.1 M43.1 M51.3 R157.2
NetM27_3: M27.3 M35.2
NetM28_1: M28.1 M44.1 M52.3 R159.2
NetM28_3: M28.3 M36.2
NetM29_1: M29.1 M45.1 M53.3 R161.2
NetM29_3: M29.3 M37.2
NetM30_1: M30.1 M38.3 R148.2
NetM31_1: M31.1 M39.3 R150.2
NetM32_1: M32.1 M40.3 R152.2
NetM33_1: M33.1 M41.3 R154.2
NetM34_1: M34.1 M42.3 R156.2
NetM35_1: M35.1 M43.3 R158.2
NetM36_1: M36.1 M44.3 R160.2
NetM37_1: M37.1 M45.3 R162.2
NetM54_1: M54.1 M57.3 R167.2
NetM54_3: M54.3 M55.1 R175.1
NetM56_1: M56.1 M57.1 M58.3 R166.2

### Notes on the sheet
- Change pull ups to 51K
- Change connection of transistor to avoid big voltage drop (serch IC one more)
- (near C29) Decoder decoupling cap
- Output voltage
- Analog signal: 20mA - 2V
- Voltage on internal resistor
- Analog signal: 20mA - 8V
- Short connection: 30mA - 3V
- Analog signal: 4mA - 0.4V
- Connection through external 390: 15.2mA - 1.52V
- Short connection: 30mA - 12V
- Analog signal: 4mA - 1.6V
- Connection through external 390: 15.2mA - 6.08V
- Error % = 3<internal resistors error %> + 2.5% + <external resistor error %>
- (near C30) Op. amp decoupling cap
- added 10nF in parallel for EMC
- Use 390 Ohm 0.25W external resistor
- (near M56) Change resistances to 820 Ohm and recalculate output voltages
- Current loops need at least 7.5V supply
- (in symbol 74HC138) DC

### Library data of the parts
C29-C32 = C
D10 = 2xD2
DA12 = 2xOP.AMP
M22-M29 M38-M53 M56-M58 = NMOS+DIODE
M30-M37 M54 M55 = PMOS+DIODE
R147-R183 = R

## Sheet Supply.SchDoc
size A1
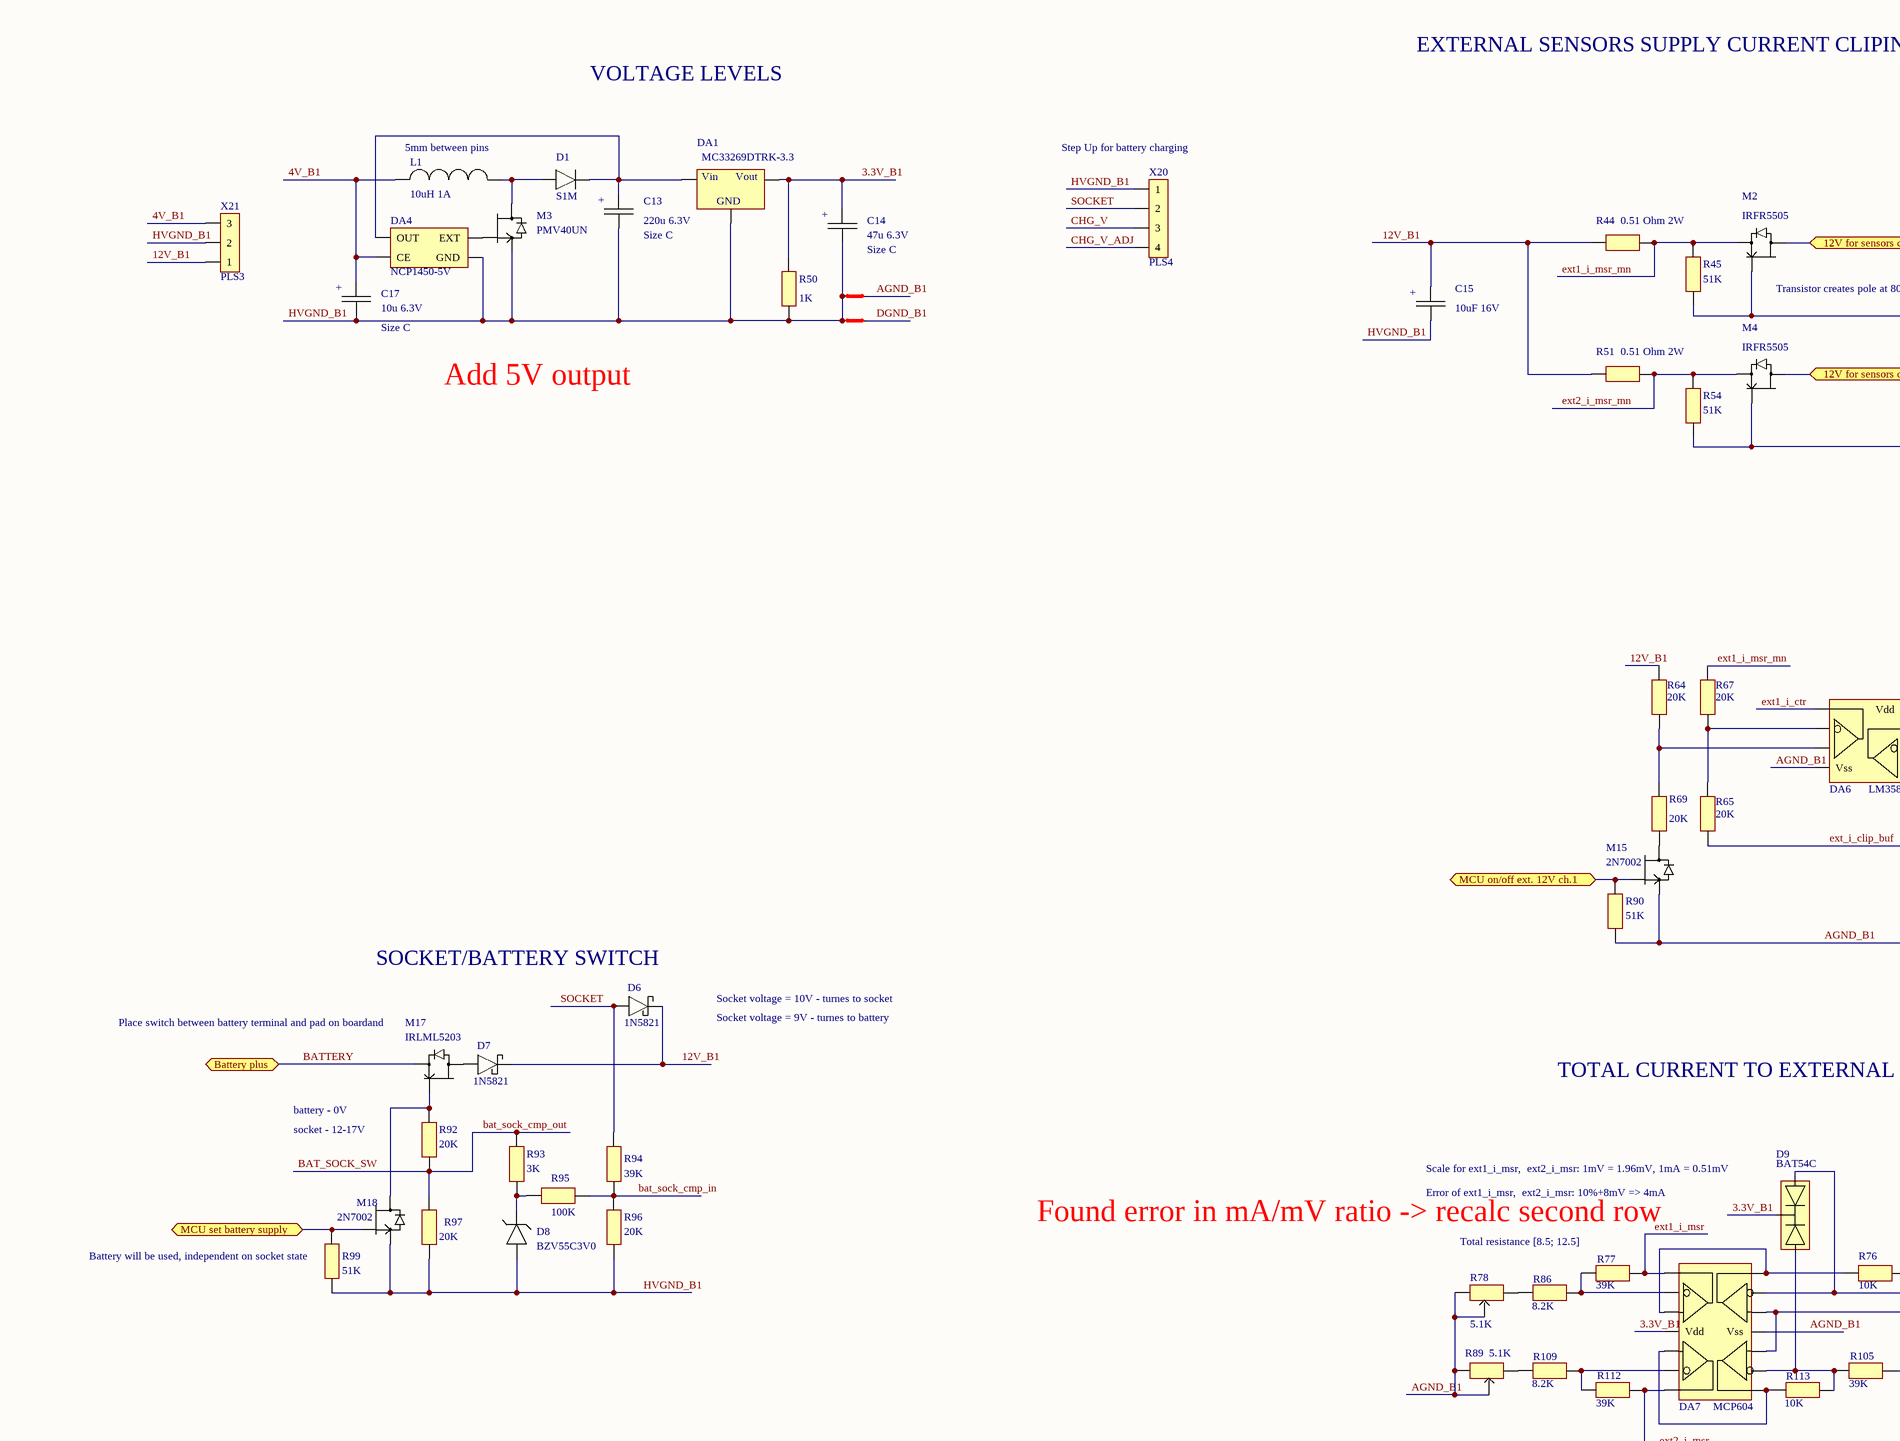
[diagram p8: Supply.SchDoc, top left]
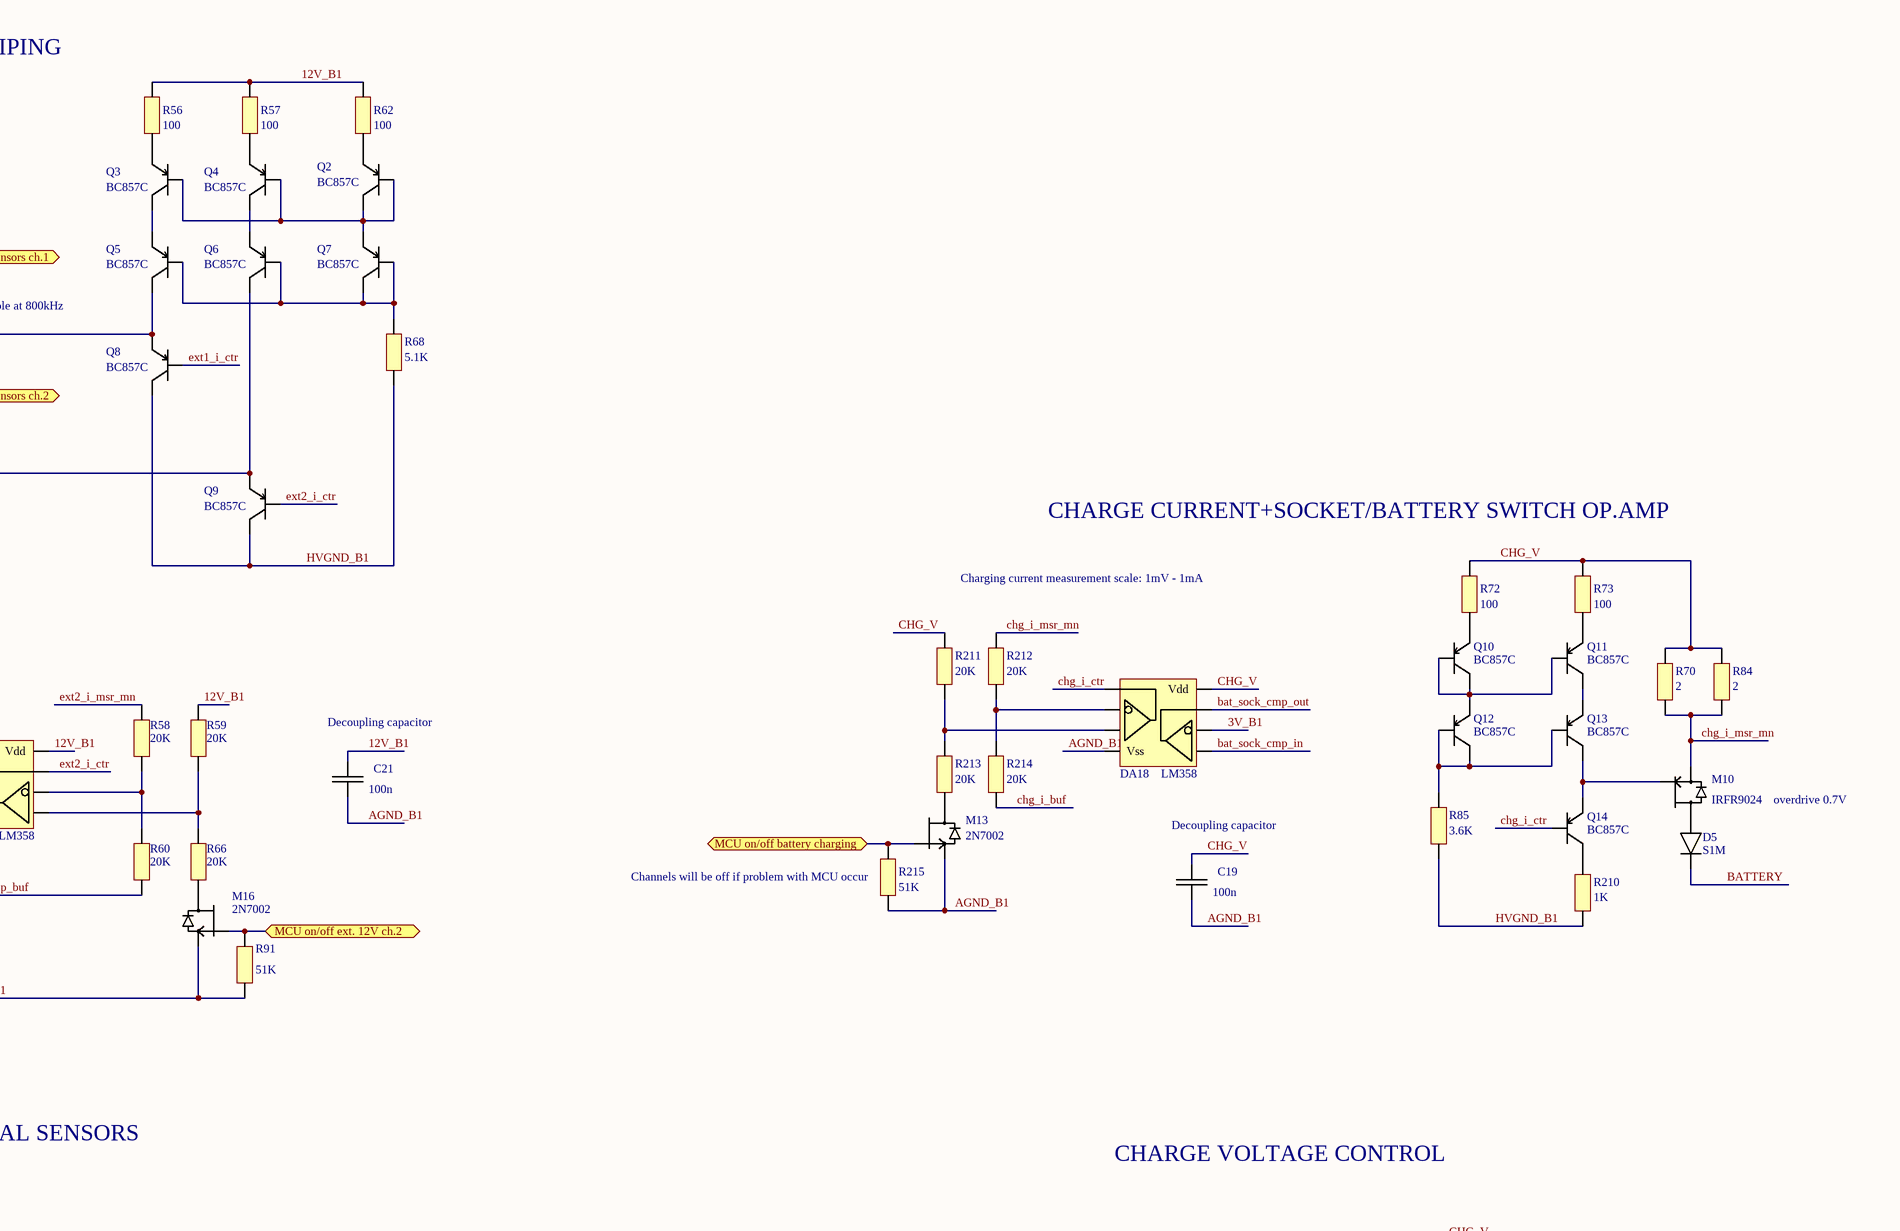
[diagram p9: Supply.SchDoc, top right]
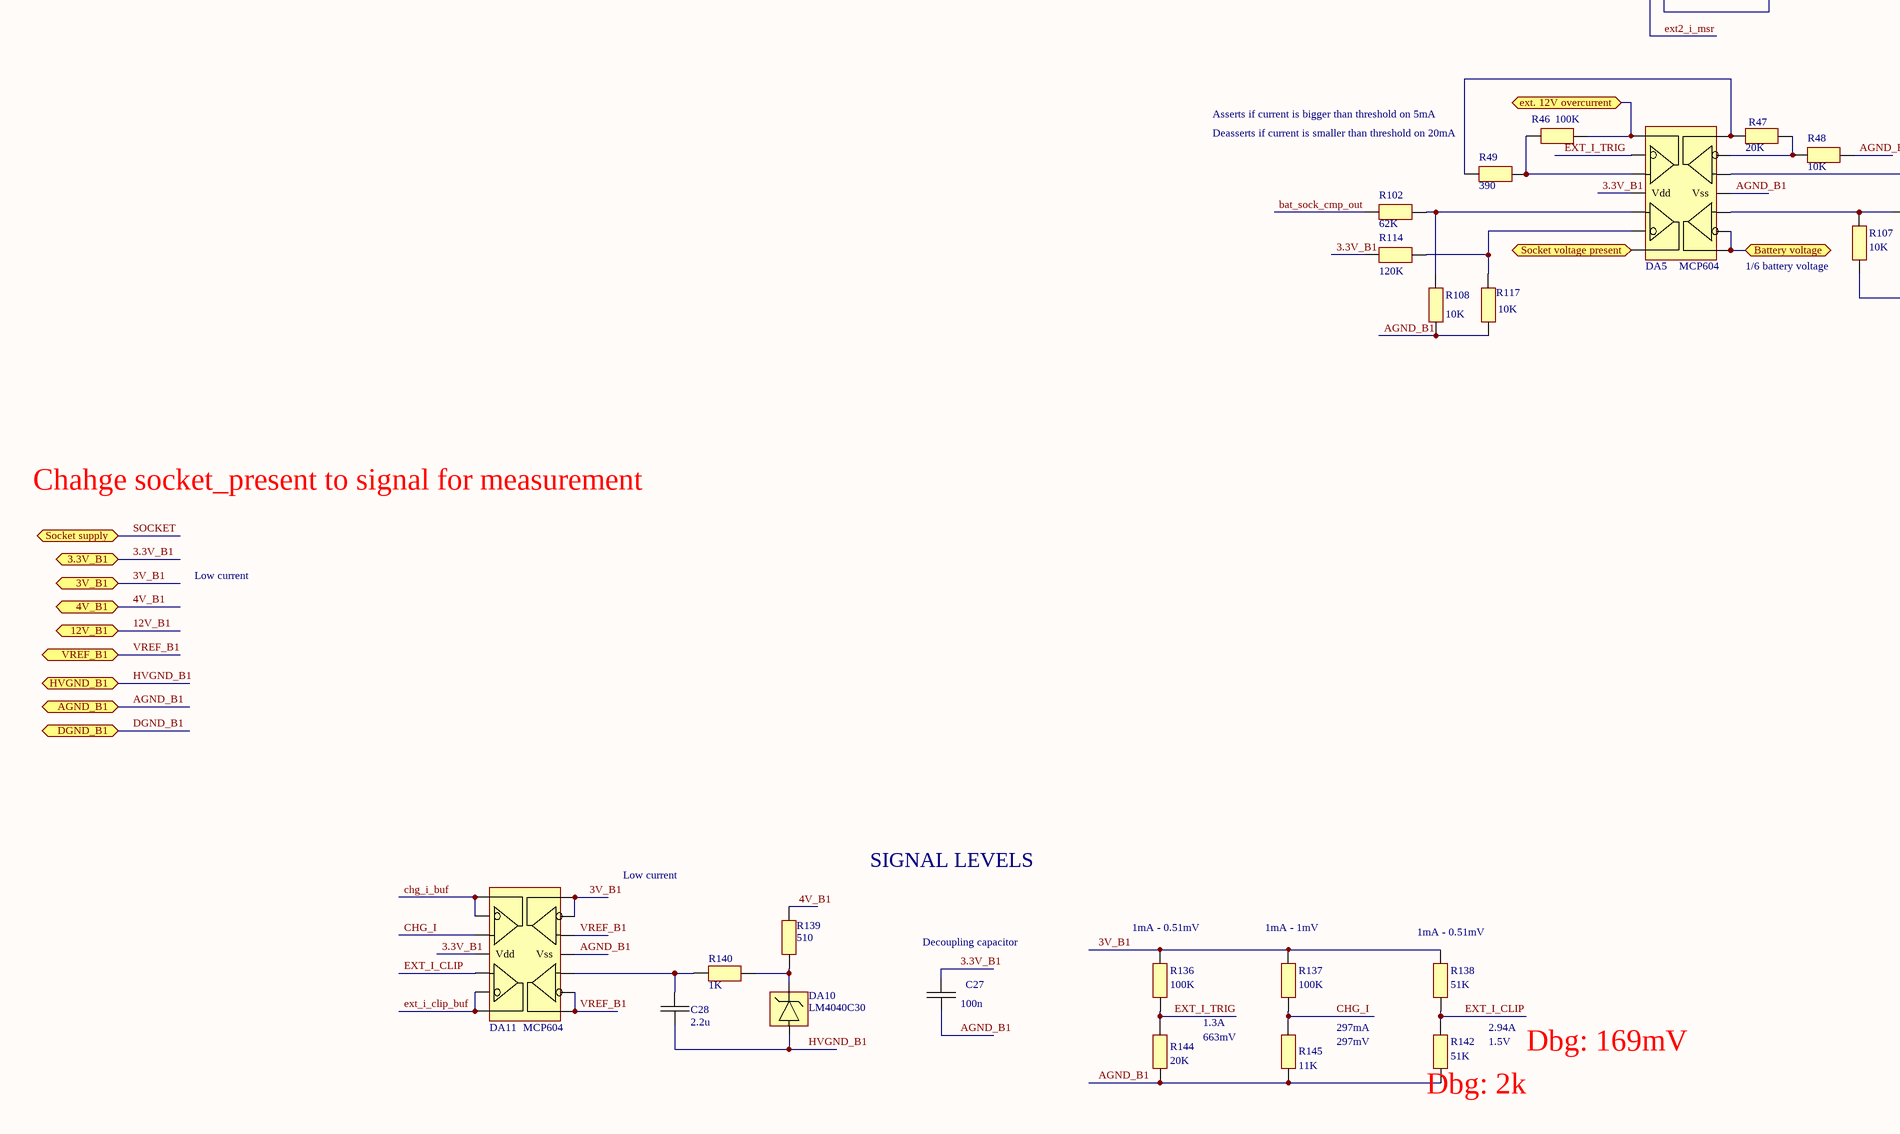
[diagram p10: Supply.SchDoc, bottom left]
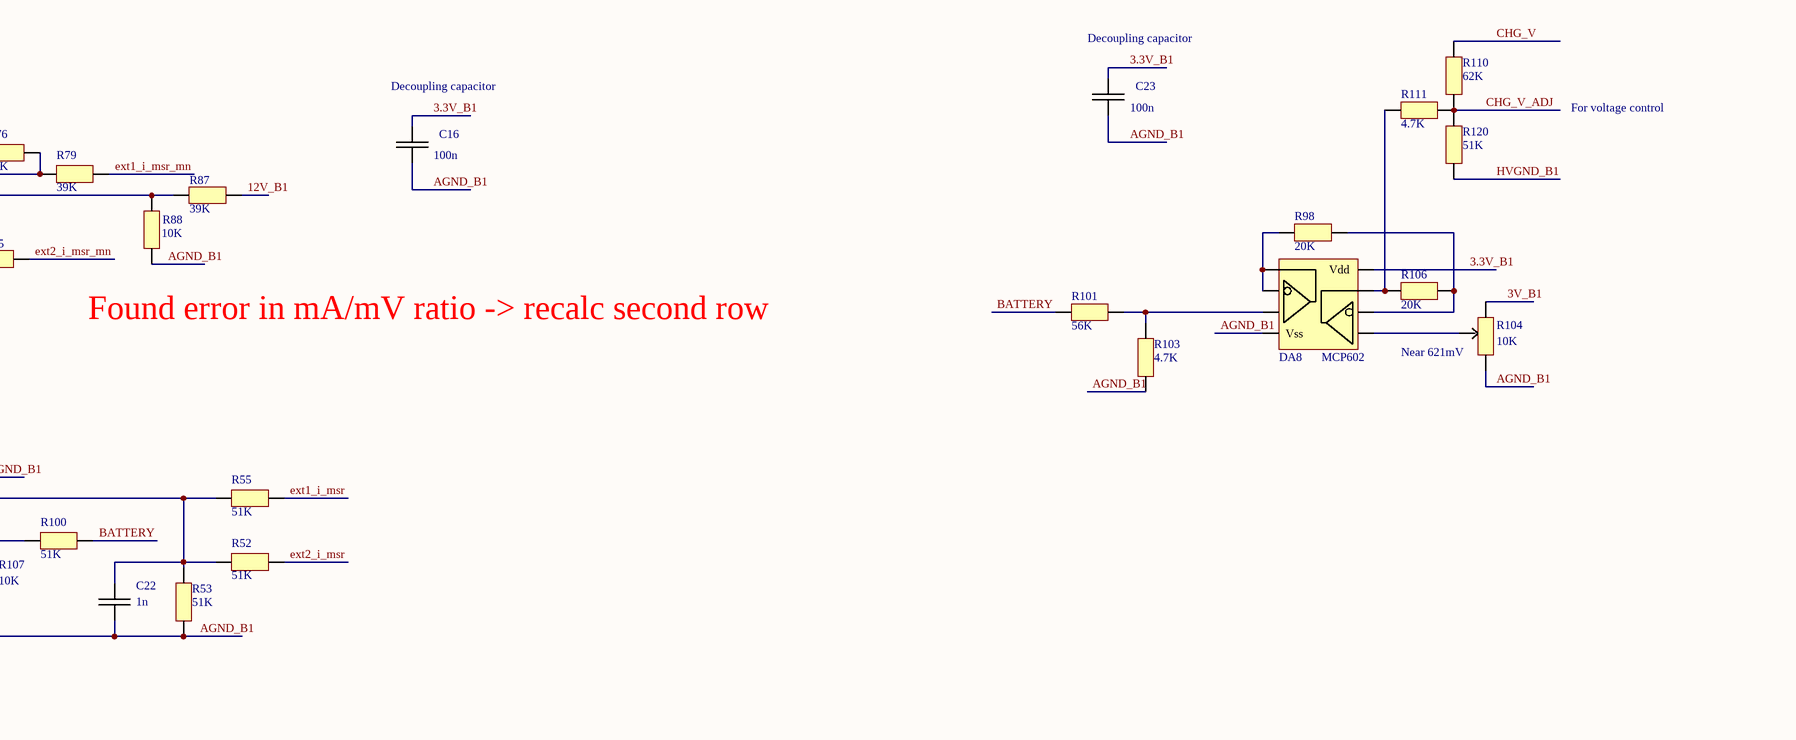
[diagram p11: Supply.SchDoc, bottom right]

### Parts
C13  220u 6.3V  [CALUM_SMD_C]
C14  47u 6.3V  [CALUM_SMD_C]
C15  10uF 16V  [CALUM_THT_E5D13]
C16  100n  [0805]
C17  10u 6.3V  [CALUM_SMD_C]
C19  100n  [0805]
C21  100n  [0805]
C22  1n  [0805]
C23  100n  [0805]
C27  100n  [0805]
C28  2.2u  [0805]
D1  S1M  [DO-214AC]
D5  S1M  [DO-214AC]
D6  1N5821  [DO-201AD]
D7  1N5821  [DO-201AD]
D8  BZV55C3V0  [SOD80]
D9  BAT54C  [SOT-23]
DA1  MC33269DTRK-3.3  [LINREG_DPAK]
DA4  NCP1450-5V  [TSSOP5]
DA5  MCP604  [SOP14]
DA6  LM358  [SOP8]
DA7  MCP604  [SOP14]
DA8  MCP602  [SOP8]
DA10  LM4040C30  [SOT-23]
DA11  MCP604  [SOP14]
DA18  LM358  [SOP8]
L1  10uH 1A  [INDUCTOR_5mm]
M2  IRFR5505  [TO-252(DPAK)]
M3  PMV40UN  [SOT-23]
M4  IRFR5505  [TO-252(DPAK)]
M10  IRFR9024  [TO-252(DPAK)]
M13  2N7002  [SOT-23]
M15  2N7002  [SOT-23]
M16  2N7002  [SOT-23]
M17  IRLML5203  [SOT-23]
M18  2N7002  [SOT-23]
N1  NetTie  [NET_TIE_1mm]  (value not drawn)  (net tie, no BOM)
N2  NetTie  [NET_TIE_1mm]  (value not drawn)  (net tie, no BOM)
Q2  BC857C  [SOT-23]
Q3  BC857C  [SOT-23]
Q4  BC857C  [SOT-23]
Q5  BC857C  [SOT-23]
Q6  BC857C  [SOT-23]
Q7  BC857C  [SOT-23]
Q8  BC857C  [SOT-23]
Q9  BC857C  [SOT-23]
Q10  BC857C  [SOT-23]
Q11  BC857C  [SOT-23]
Q12  BC857C  [SOT-23]
Q13  BC857C  [SOT-23]
Q14  BC857C  [SOT-23]
R44  0.51 Ohm 2W  [RES_2W]
R45  51K  [0805]
R46  100K  [0805]
R47  20K  [0805]
R48  10K  [0805]
R49  390  [0805]
R50  1K  [0805]
R51  0.51 Ohm 2W  [RES_2W]
R52  51K  [0805]
R53  51K  [0805]
R54  51K  [0805]
R55  51K  [0805]
R56  100  [0805]
R57  100  [0805]
R58  20K  [0805]
R59  20K  [0805]
R60  20K  [0805]
R62  100  [0805]
R64  20K  [0805]
R65  20K  [0805]
R66  20K  [0805]
R67  20K  [0805]
R68  5.1K  [0805]
R69  20K  [0805]
R70  2  [1206]
R72  100  [0805]
R73  100  [0805]
R76  10K  [0805]
R77  39K  [0805]
R78  5.1K  [3305SMD(adj res)]
R79  39K  [0805]
R84  2  [1206]
R85  3.6K  [0805]
R86  8.2K  [0805]
R87  39K  [0805]
R88  10K  [0805]
R89  5.1K  [3305SMD(adj res)]
R90  51K  [0805]
R91  51K  [0805]
R92  20K  [0805]
R93  3K  [0805]
R94  39K  [0805]
R95  100K  [0805]
R96  20K  [0805]
R97  20K  [0805]
R98  20K  [0805]
R99  51K  [0805]
R100  51K  [0805]
R101  56K  [0805]
R102  62K  [0805]
R103  4.7K  [0805]
R104  10K  [3296 X W(ADJ RES)]
R105  39K  [0805]
R106  20K  [0805]
R107  10K  [0805]
R108  10K  [0805]
R109  8.2K  [0805]
R110  62K  [0805]
R111  4.7K  [0805]
R112  39K  [0805]
R113  10K  [0805]
R114  120K  [0805]
R117  10K  [0805]
R120  51K  [0805]
R136  100K  [0805]
R137  100K  [0805]
R138  51K  [0805]
R139  510  [0805]
R140  1K  [0805]
R142  51K  [0805]
R144  20K  [0805]
R145  11K  [0805]
R210  1K  [0805]
R211  20K  [0805]
R212  20K  [0805]
R213  20K  [0805]
R214  20K  [0805]
R215  51K  [0805]
X20  PLS4  [PLS_4_BIG]
X21  PLS3  [PLS_3_BIG]

### Ports
3.3V_B1, 3V_B1, 4V_B1, 12V for sensors ch.1, 12V for sensors ch.2, 12V_B1, AGND_B1, Battery plus, Battery voltage, DGND_B1, ext. 12V overcurrent, HVGND_B1, MCU on/off battery charging, MCU on/off ext. 12V ch.1, MCU on/off ext. 12V ch.2, MCU set battery supply, Socket supply, Socket voltage present, VREF_B1

### Nets
3.3V_B1: C14.1 C16.2 C23.2 C27.2 D9.3(AK) DA1.out(Vout) DA5.4(Vdd) DA7.4(Vdd) DA8.8(Vdd) DA11.4(Vdd) R50.1 R114.2 ; port 3.3V_B1
3V_B1: DA11.13 DA11.14 DA18.6 R104.1 R136.1 R137.1 R138.1 ; port 3V_B1
4V_B1: C17.1 DA4.1(CE) L1.2 R139.1 X21.3 ; port 4V_B1
12V_B1: C15.1 C21.2 D6.2 D7.2 DA6.8(Vdd) R44.2 R51.2 R56.1 R57.1 R59.2 R62.1 R64.2 R87.1 X21.1 ; port 12V_B1
AGND_B1: C16.1 C19.1 C21.1 C22.1 C23.1 C27.1 DA5.11(Vss) DA6.4(Vss) DA7.11(Vss) DA8.4(Vss) DA11.11(Vss) DA18.4(Vss) M13.2 M15.2 M16.2 N1.2 R48.1 R53.1 R78.1 R78.3 R88.2 R89.2 R89.3 R90.2 R91.2 R103.2 R104.2 R107.1 R108.2 R117.2 R142.2 R144.2 R145.2 R215.2 ; port AGND_B1
BAT_CHARGE_B1: M13.1 R215.1 ; port MCU on/off battery charging
bat_sock_cmp_in: DA18.5 R94.2 R95.2 R96.1
bat_sock_cmp_out: DA18.7 R92.2 R93.1 R97.1 R102.1  [also labelled BAT_SOCK_SW]
BAT_VOLT_B1: DA5.8 DA5.9 ; port Battery voltage
BATTERY: D5.2 M17.2 R100.2 R101.2 ; port Battery plus
CHG_I: DA11.3 R137.2 R145.1
chg_i_buf: DA11.1 DA11.2 R214.2
chg_i_ctr: DA18.1 Q14.1(B)
chg_i_msr_mn: M10.2 R70.2 R84.2 R212.1
CHG_V: C19.2 DA18.8(Vdd) R70.1 R72.1 R73.1 R84.1 R110.1 R211.1 X20.3
CHG_V_ADJ: R110.2 R111.2 R120.1 X20.4
DGND_B1: N2.2 ; port DGND_B1
ext1_i_ctr: DA6.1 Q8.1(B)
ext1_i_msr: DA7.1 R55.1 R77.2
ext1_i_msr_mn: M2.2 R44.1 R45.1 R67.2 R79.1
ext2_i_ctr: DA6.7 Q9.1(B)
ext2_i_msr: DA7.7 R52.1 R112.2
ext2_i_msr_mn: M4.2 R51.1 R54.1 R58.2 R105.2
EXT_12V_CH1: M2.3 ; port 12V for sensors ch.1
EXT_12V_CH1_KEY_B1: M15.1 R90.1 ; port MCU on/off ext. 12V ch.1
EXT_12V_CH2: M4.3 ; port 12V for sensors ch.2
EXT_12V_CH2_KEY_B1: M16.1 R91.1 ; port MCU on/off ext. 12V ch.2
EXT_12V_OVERCUR_B1: DA5.1 R46.1 ; port ext. 12V overcurrent
EXT_I_CLIP: DA11.5 R138.2 R142.1
ext_i_clip_buf: DA11.6 DA11.7 R60.2 R65.1
EXT_I_TRIG: DA5.2 R136.2 R144.1
HVGND_B1: C13.2 C14.2 C15.2 C17.2 C28.1 D8.1(A) DA1.gnd(GND) DA4.4(GND) DA10.2(A) M3.2 M18.2 N1.1 N2.1 Q8.3(C) Q9.3(C) R50.2 R68.2 R85.2 R96.2 R97.2 R99.2 R120.2 R210.2 X20.1 X21.2 ; port HVGND_B1
SET_BAT_SUPPLY_B1: M18.1 R99.1 ; port MCU set battery supply
SOCK_VOLT_PRES_B1: DA5.7 ; port Socket voltage present
SOCKET: D6.1 R94.1 X20.2 ; port Socket supply
VREF_B1: DA11.8 DA11.9 DA11.12 ; port VREF_B1
NetC13_1: C13.1 D1.2 DA1.in(Vin) DA4.2(OUT)
NetC22_2: C22.2 DA5.12 R52.2 R53.2 R55.2
NetC28_2: C28.2 DA11.10 R140.1
NetD1_1: D1.1 L1.1 M3.3
NetD5_1: D5.1 M10.3
NetD7_1: D7.1 M17.3
NetD8_2: D8.2(K) R93.2 R95.1
NetD9_1: D9.1(A1) DA7.13 R76.1 R79.2
NetD9_2: D9.2(K2) DA7.9 R105.1 R113.2
NetDA4_5: DA4.5(EXT) M3.1
NetDA5_3: DA5.3 R46.2 R49.1
NetDA5_5: DA5.5 R102.2 R108.1
NetDA5_6: DA5.6 R114.1 R117.1
NetDA5_10: DA5.10 R100.1 R107.2
NetDA5_13: DA5.13 R47.1 R48.2
NetDA5_14: DA5.14 R47.2 R49.2
NetDA6_2: DA6.2 R65.2 R67.1
NetDA6_3: DA6.3 R64.1 R69.1
NetDA6_5: DA6.5 R59.1 R66.1
NetDA6_6: DA6.6 R58.1 R60.1
NetDA7_2: DA7.2 R77.1 R86.2
NetDA7_3: DA7.3 DA7.14 R76.2
NetDA7_5: DA7.5 DA7.8 R113.1
NetDA7_6: DA7.6 R109.2 R112.1
NetDA7_10: DA7.10 DA7.12 R87.2 R88.1
NetDA8_1: DA8.1 DA8.2 R98.1
NetDA8_3: DA8.3 R101.1 R103.1
NetDA8_5: DA8.5 R104.3
NetDA8_6: DA8.6 R98.2 R106.2
NetDA8_7: DA8.7 R106.1 R111.1
NetDA10_1: DA10.1(K) R139.2 R140.2
NetDA18_2: DA18.2 R212.2 R214.1
NetDA18_3: DA18.3 R211.2 R213.1
NetM2_1: M2.1 Q5.3(C) Q8.2(E) R45.2
NetM4_1: M4.1 Q6.3(C) Q9.2(E) R54.2
NetM10_1: M10.1 Q13.3(C) Q14.2(E)
NetM13_3: M13.3 R213.2
NetM15_3: M15.3 R69.2
NetM16_3: M16.3 R66.2
NetM17_1: M17.1 M18.3 R92.1
NetQ2_1: Q2.1(B) Q2.3(C) Q3.1(B) Q4.1(B) Q7.2(E)
NetQ2_2: Q2.2(E) R62.2
NetQ3_2: Q3.2(E) R56.2
NetQ3_3: Q3.3(C) Q5.2(E)
NetQ4_2: Q4.2(E) R57.2
NetQ4_3: Q4.3(C) Q6.2(E)
NetQ5_1: Q5.1(B) Q6.1(B) Q7.1(B) Q7.3(C) R68.1
NetQ10_1: Q10.1(B) Q10.3(C) Q11.1(B) Q12.2(E)
NetQ10_2: Q10.2(E) R72.2
NetQ11_2: Q11.2(E) R73.2
NetQ11_3: Q11.3(C) Q13.2(E)
NetQ12_1: Q12.1(B) Q12.3(C) Q13.1(B) R85.1
NetQ14_3: Q14.3(C) R210.1
NetR78_2: R78.2 R86.1
NetR89_1: R89.1 R109.1

### Notes on the sheet
- EXTERNAL SENSORS SUPPLY CURRENT CLIPING
- VOLTAGE LEVELS
- (near L1) 5mm between pins
- (near X20) Step Up for battery charging
- Size C
- (near M2) Transistor creates pole at 800kHz
- (near C17) Size C
- Add 5V output
- CHARGE CURRENT+SOCKET/BATTERY SWITCH OP.AMP
- Charging current measurement scale: 1mV - 1mA
- (near C21) Decoupling capacitor
- Decoupling capacitor
- overdrive 0.7V
- (near R215) Channels will be off if problem with MCU occur
- (near D6) SOCKET/BATTERY SWITCH
- (near M17) Place switch between battery terminal and pad on boardand
- Socket voltage = 10V - turnes to socket
- Socket voltage = 9V - turnes to battery
- battery - 0V
- TOTAL CURRENT TO EXTERNAL SENSORS
- CHARGE VOLTAGE CONTROL
- socket - 12-17V
- (near D9) Scale for ext1_i_msr,  ext2_i_msr: 1mV = 1.96mV, 1mA = 0.51mV
- (near C23) Decoupling capacitor
- Found error in mA/mV ratio -> recalc second row
- Error of ext1_i_msr,  ext2_i_msr: 10%+8mV => 4mA
- (near C16) Decoupling capacitor
- For voltage control
- (near R99) Battery will be used, independent on socket state
- (near R77) Total resistance [8.5; 12.5]
- (near R88) Found error in mA/mV ratio -> recalc second row
- (near R104) Near 621mV
- Asserts if current is bigger than threshold on 5mA
- Deasserts if current is smaller than threshold on 20mA
- (near R107) 1/6 battery voltage
- Chahge socket_present to signal for measurement
- Low current
- (near DA11) Low current
- SIGNAL LEVELS
- (near C27) Decoupling capacitor
- (near R136) 1mA - 0.51mV
- (near R137) 1mA - 1mV
- (near R138) 1mA - 0.51mV
- 1.3A
- 663mV
- 297mA
- 2.94A
- 297mV
- (near R142) Dbg: 2k
- 1.5V
- Dbg: 169mV
- (in symbol C_POL) +

### Library data of the parts
C13-C15 C17 = C_POL
C16 C19 C21-C23 C27 C28 = C
D1 D5 = D
D6 D7 = D_Shottky
D8 = Zener diode
D9 = 2xD2
DA1 = LINEAR_REGULATOR
DA4 = ncp1450
DA5 DA7 DA11 = 4xOP.AMP
DA6 DA8 DA18 = 2xOP.AMP
DA10 = Shunt_VREF
L1 = Inductor
M2 M4 M10 M17 = PMOS+DIODE
M3 M13 M15 M16 M18 = NMOS+DIODE
Q2-Q14 = PNP
R44-R60 R62 R64-R70 R72 R73 R76 R77 R79 R84-R88 R90-R103 R105-R114 R117 R120 R136-R140 R142 R144 R145 R210-R215 = R
R78 R89 R104 = Radj
X20 = CONT_4
X21 = CONT_3

## Sheet Analog.SchDoc
size A2
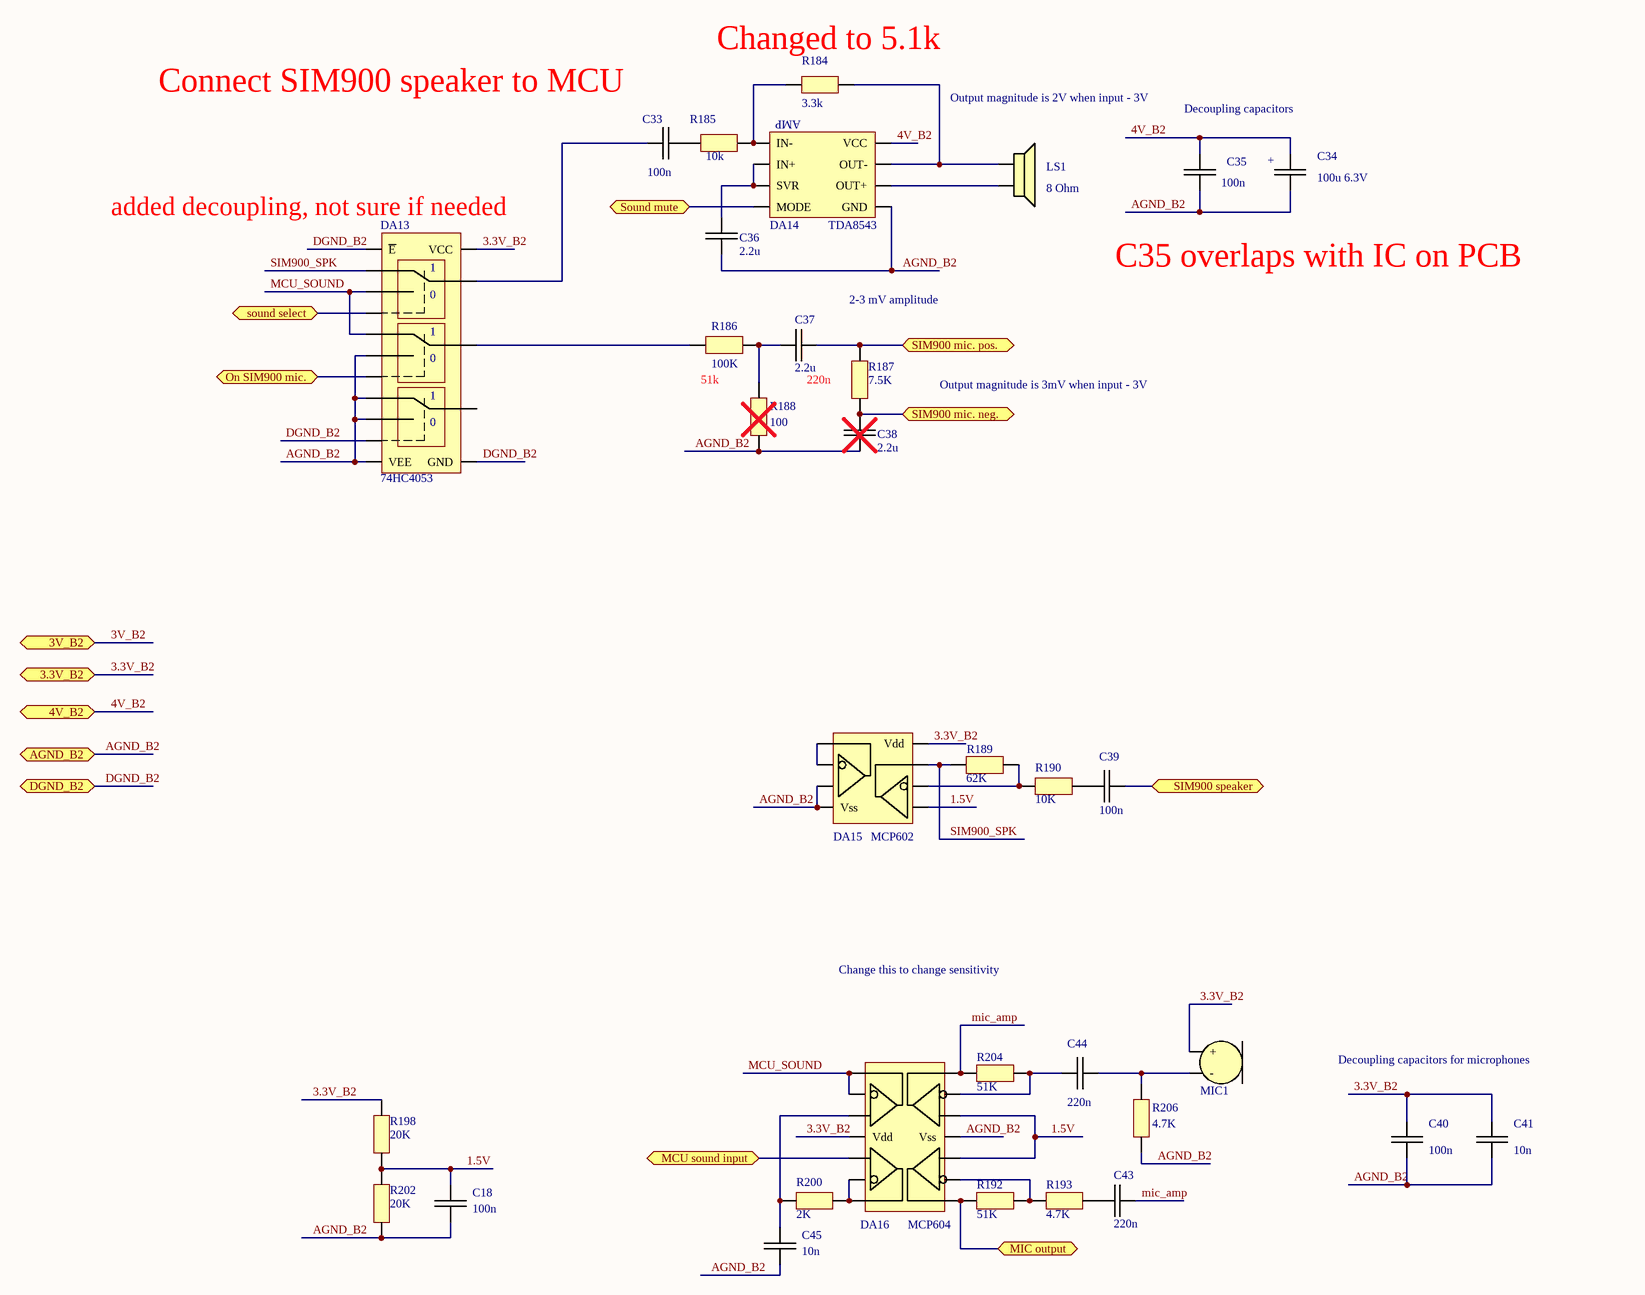
[diagram p12: Analog.SchDoc]

### Parts
C18  100n  [0805]
C33  100n  [0805]
C34  100u 6.3V  [CALUM_SMD_C]
C35  100n  [0805]
C36  2.2u  [0805]
C37  2.2u  [0805]
C38  2.2u  [0805]
C39  100n  [0805]
C40  100n  [0805]
C41  10n  [0805]
C43  220n  [0805]
C44  220n  [0805]
C45  10n  [0805]
DA13  74HC4053  [SOP16]
DA14  TDA8543  [SOP16]
DA15  MCP602  [SOP8]
DA16  MCP604  [SOP14]
LS1  8 Ohm  [PLS_2]
MIC1  MIC  [MIC_6.0x5.2]  (value not drawn)
R184  3.3k  [0805]
R185  10k  [0805]
R186  100K  [0805]
R187  7.5K  [0805]
R188  100  [0805]
R189  62K  [0805]
R190  10K  [0805]
R192  51K  [0805]
R193  4.7K  [0805]
R198  20K  [0805]
R200  2K  [0805]
R202  20K  [0805]
R204  51K  [0805]
R206  4.7K  [0805]

### Ports
3.3V_B2, 3V_B2, 4V_B2, AGND_B2, DGND_B2, MCU sound input, MIC output, On SIM900 mic., SIM900 mic. neg., SIM900 mic. pos., SIM900 speaker, Sound mute, sound select

### Nets
1.5V: C18.2 DA15.5 DA16.10 DA16.12 R198.2 R202.1
3.3V_B2: C40.2 C41.2 DA13.16(VCC) DA15.8(Vdd) DA16.4(Vdd) MIC1.+ R198.1 ; port 3.3V_B2
4V_B2: C34.1 C35.2 DA14.12(VCC) ; port 4V_B2
AGND_B2: C18.1 C34.2 C35.1 C36.2 C38.2 C40.1 C41.1 C45.1 DA13.5 DA13.7(VEE) DA13.12 DA13.13 DA14.13(GND) DA15.3 DA15.4(Vss) DA16.11(Vss) R188.2 R202.2 R206.2 ; port AGND_B2
DGND_B2: DA13.6(~{E}) DA13.8(GND) DA13.11 ; port DGND_B2
MCU_AMP_IN: DA16.5 ; port MCU sound input
MCU_SOUND: DA13.2 DA13.3 DA16.1 DA16.2
mic_amp: C43.2 DA16.14 R204.1
MIC_OUT: DA16.8 R192.1 ; port MIC output
SIM900_MIC_KEY: DA13.9 ; port On SIM900 mic.
SIM900_MIC_MN: C38.1 R187.2 ; port SIM900 mic. neg.
SIM900_MIC_PL: C37.1 R187.1 ; port SIM900 mic. pos.
SIM900_SPK: DA13.1 DA15.7 R189.2
SIM900_SPK_PL: C39.2 ; port SIM900 speaker
SOUND_MUTE: DA14.3(MODE) ; port Sound mute
SOUND_SRC_SEL: DA13.10 ; port sound select
NetC33_1: C33.1 DA13.15
NetC33_2: C33.2 R185.2
NetC36_1: C36.1 DA14.4(SVR) DA14.5(IN+)
NetC37_2: C37.2 R186.2 R188.1
NetC39_1: C39.1 R190.1
NetC43_1: C43.1 R193.1
NetC44_1: C44.1 DA16.13 R204.2
NetC44_2: C44.2 MIC1.- R206.1
NetC45_2: C45.2 DA16.3 R200.2
NetDA13_4: DA13.4 R186.1
NetDA14_6: DA14.6(IN-) R184.2 R185.1
NetDA14_11: DA14.11(OUT-) LS1.1 R184.1
NetDA14_14: DA14.14(OUT+) LS1.2
NetDA15_1: DA15.1 DA15.2
NetDA15_6: DA15.6 R189.1 R190.2
NetDA16_6: DA16.6 DA16.7 R200.1
NetDA16_9: DA16.9 R192.2 R193.2

Not connected (* = marked no-connect by the designer): DA13 14

### Notes on the sheet
- Connect SIM900 speaker to MCU
- (near R184) Changed to 5.1k
- Output magnitude is 2V when input - 3V
- Decoupling capacitors
- (near DA13) added decoupling, not sure if needed
- 2-3 mV amplitude
- C35 overlaps with IC on PCB
- 51k
- 220n
- Output magnitude is 3mV when input - 3V
- Change this to change sensitivity
- Decoupling capacitors for microphones
- (in symbol 74HCx4053) 0
- (in symbol C_POL) +
- (in symbol TDA8543) AMP

### Library data of the parts
C18 C33 C35-C41 C43-C45 = C
C34 = C_POL
DA13 = 74HCx4053
DA15 = 2xOP.AMP
DA16 = 4xOP.AMP
LS1 = Speaker
R184-R190 R192 R193 R198 R200 R202 R204 R206 = R

## Nets that join several sheets
3.3V_B1: ClubNIKA (X24.3 X24.4), Zones (6 pins), Supply (12 pins)
3.3V_B2: ClubNIKA (45 pins), Analog (7 pins)
3V_B1: ClubNIKA (X24.5), Supply (7 pins)
4V_B1: ClubNIKA (X26.1 X27.1), Supply (5 pins)
4V_B2: ClubNIKA (5 pins), Analog (C34.1 C35.2 DA14.12)
12V_B1: Zones (20 pins), Supply (14 pins)
AGND_B1: ClubNIKA (X24.2), Zones (7 pins), Supply (34 pins)
AGND_B2: ClubNIKA (5 pins), Analog (19 pins)
BAT_CHARGE_B1: ClubNIKA (X26.3), Supply (M13.1 R215.1)
BAT_VOLT_B1: ClubNIKA (X30.5), Supply (DA5.8 DA5.9)
BATTERY: ClubNIKA (X19.1), Supply (D5.2 M17.2 R100.2 R101.2)
CH1_IN: ClubNIKA (X8.2), Zones (M30.3)
CH2_IN: ClubNIKA (X8.3), Zones (M31.3)
CH3_IN: ClubNIKA (X9.2), Zones (M32.3)
CH4_IN: ClubNIKA (X9.3), Zones (M33.3)
CH5_IN: ClubNIKA (X10.2), Zones (M34.3)
CH6_IN: ClubNIKA (X10.3), Zones (M35.3)
CH7_IN: ClubNIKA (X12.2), Zones (M36.3)
CH8_IN: ClubNIKA (X12.3), Zones (M37.3)
CH_CUR_SINK_B1: ClubNIKA (X32.2), Zones (C31.2 R182.2)
CH_CUR_SRC_B1: ClubNIKA (X32.1), Zones (C32.2 R183.1)
CH_DIR_B1: ClubNIKA (X32.3), Zones (M58.1 R180.1)
CH_SEL0_B1: ClubNIKA (X22.1), Zones (DD4.1 R163.1)
CH_SEL1_B1: ClubNIKA (X22.2), Zones (DD4.2 R164.1)
CH_SEL2_B1: ClubNIKA (X22.3), Zones (DD4.3 R165.1)
DGND_B1: ClubNIKA (X24.1), Zones (27 pins), Supply (N2.2)
DGND_B2: ClubNIKA (39 pins), Analog (DA13.6 DA13.8 DA13.11)
EXT_12V_CH1: ClubNIKA (X8.1 X10.1 X13.1), Supply (M2.3)
EXT_12V_CH1_KEY_B1: ClubNIKA (X30.1), Supply (M15.1 R90.1)
EXT_12V_CH2: ClubNIKA (X13.2), Supply (M4.3)
EXT_12V_CH2_KEY_B1: ClubNIKA (X30.2), Supply (M16.1 R91.1)
EXT_12V_OVERCUR_B1: ClubNIKA (X30.3), Supply (DA5.1 R46.1)
HVGND_B1: ClubNIKA (8 pins), Supply (25 pins)
MCU_AMP_IN: ClubNIKA (DD2.29), Analog (DA16.5)
MIC_OUT: ClubNIKA (DD2.34), Analog (DA16.8 R192.1)
SET_BAT_SUPPLY_B1: ClubNIKA (X27.3), Supply (M18.1 R99.1)
SIM900_MIC_KEY: ClubNIKA (DD2.42), Analog (DA13.9)
SIM900_MIC_MN: ClubNIKA (DD1.20), Analog (C38.1 R187.2)
SIM900_MIC_PL: ClubNIKA (DD1.19), Analog (C37.1 R187.1)
SIM900_SPK_PL: ClubNIKA (DD1.21), Analog (C39.2)
SOCK_VOLT_PRES_B1: ClubNIKA (X30.4), Supply (DA5.7)
SOCKET: ClubNIKA (X18.+), Supply (D6.1 R94.1 X20.2)
SOUND_MUTE: ClubNIKA (DD2.41), Analog (DA14.3)
SOUND_SRC_SEL: ClubNIKA (DD2.43), Analog (DA13.10)
VREF_B1: ClubNIKA (X24.6), Supply (DA11.8 DA11.9 DA11.12)